# EAGLE design PoElli-Nucleo (EAGLE 7.1.0)
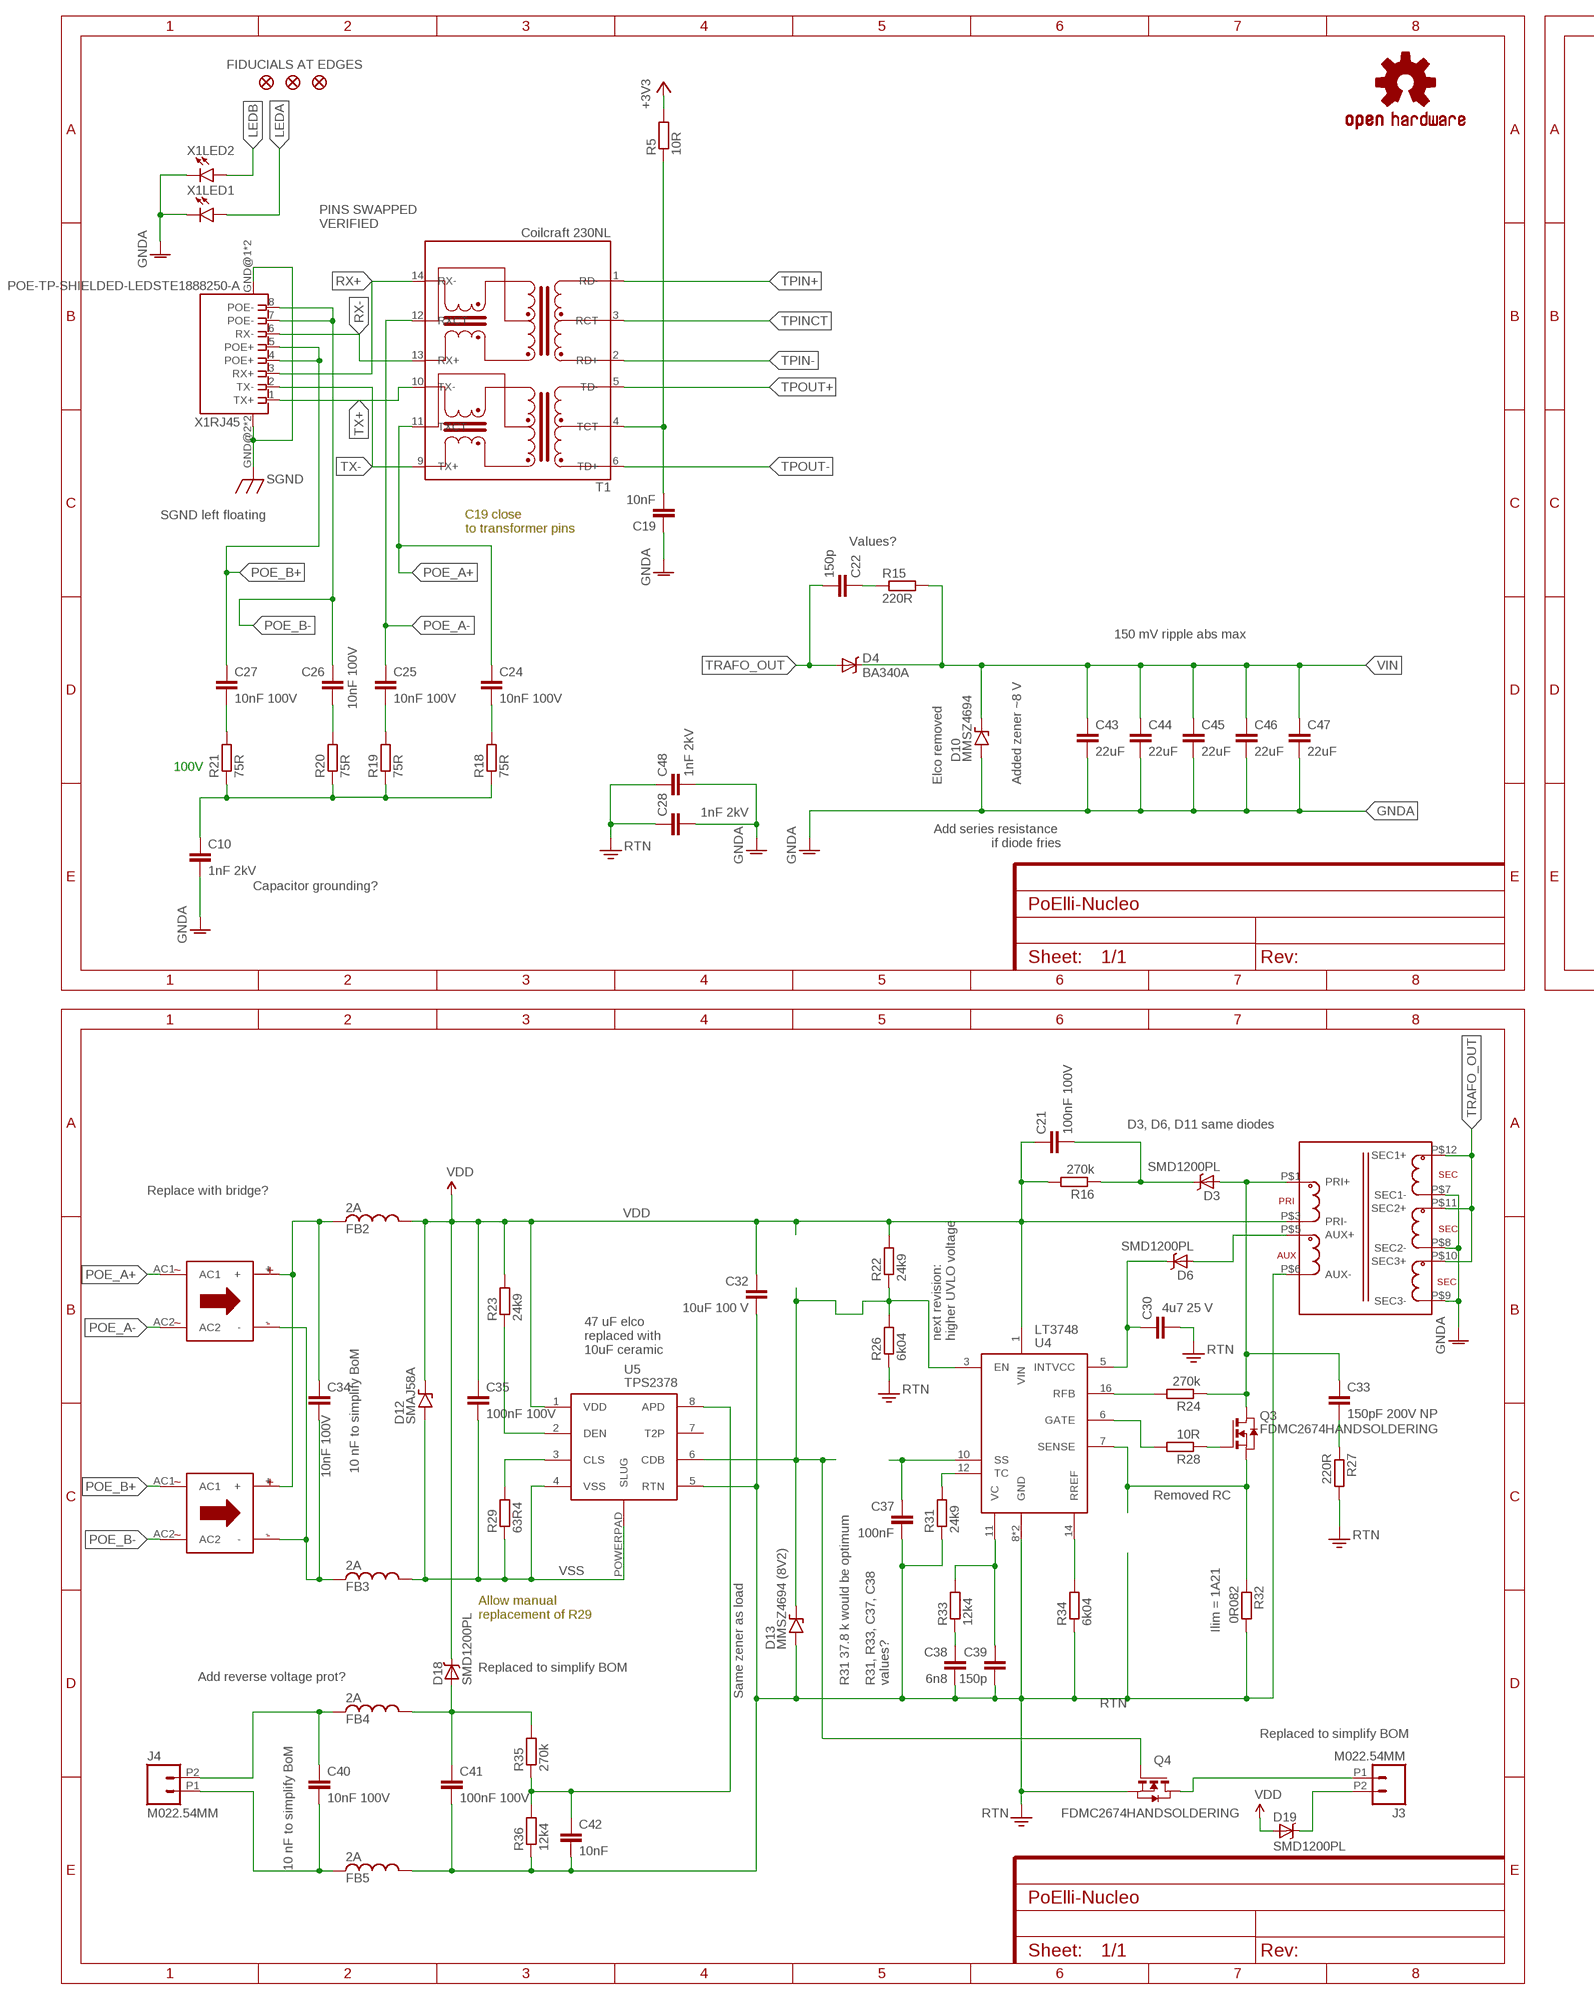
[diagram p0: schematic, sheet 1, part 1 of 2]
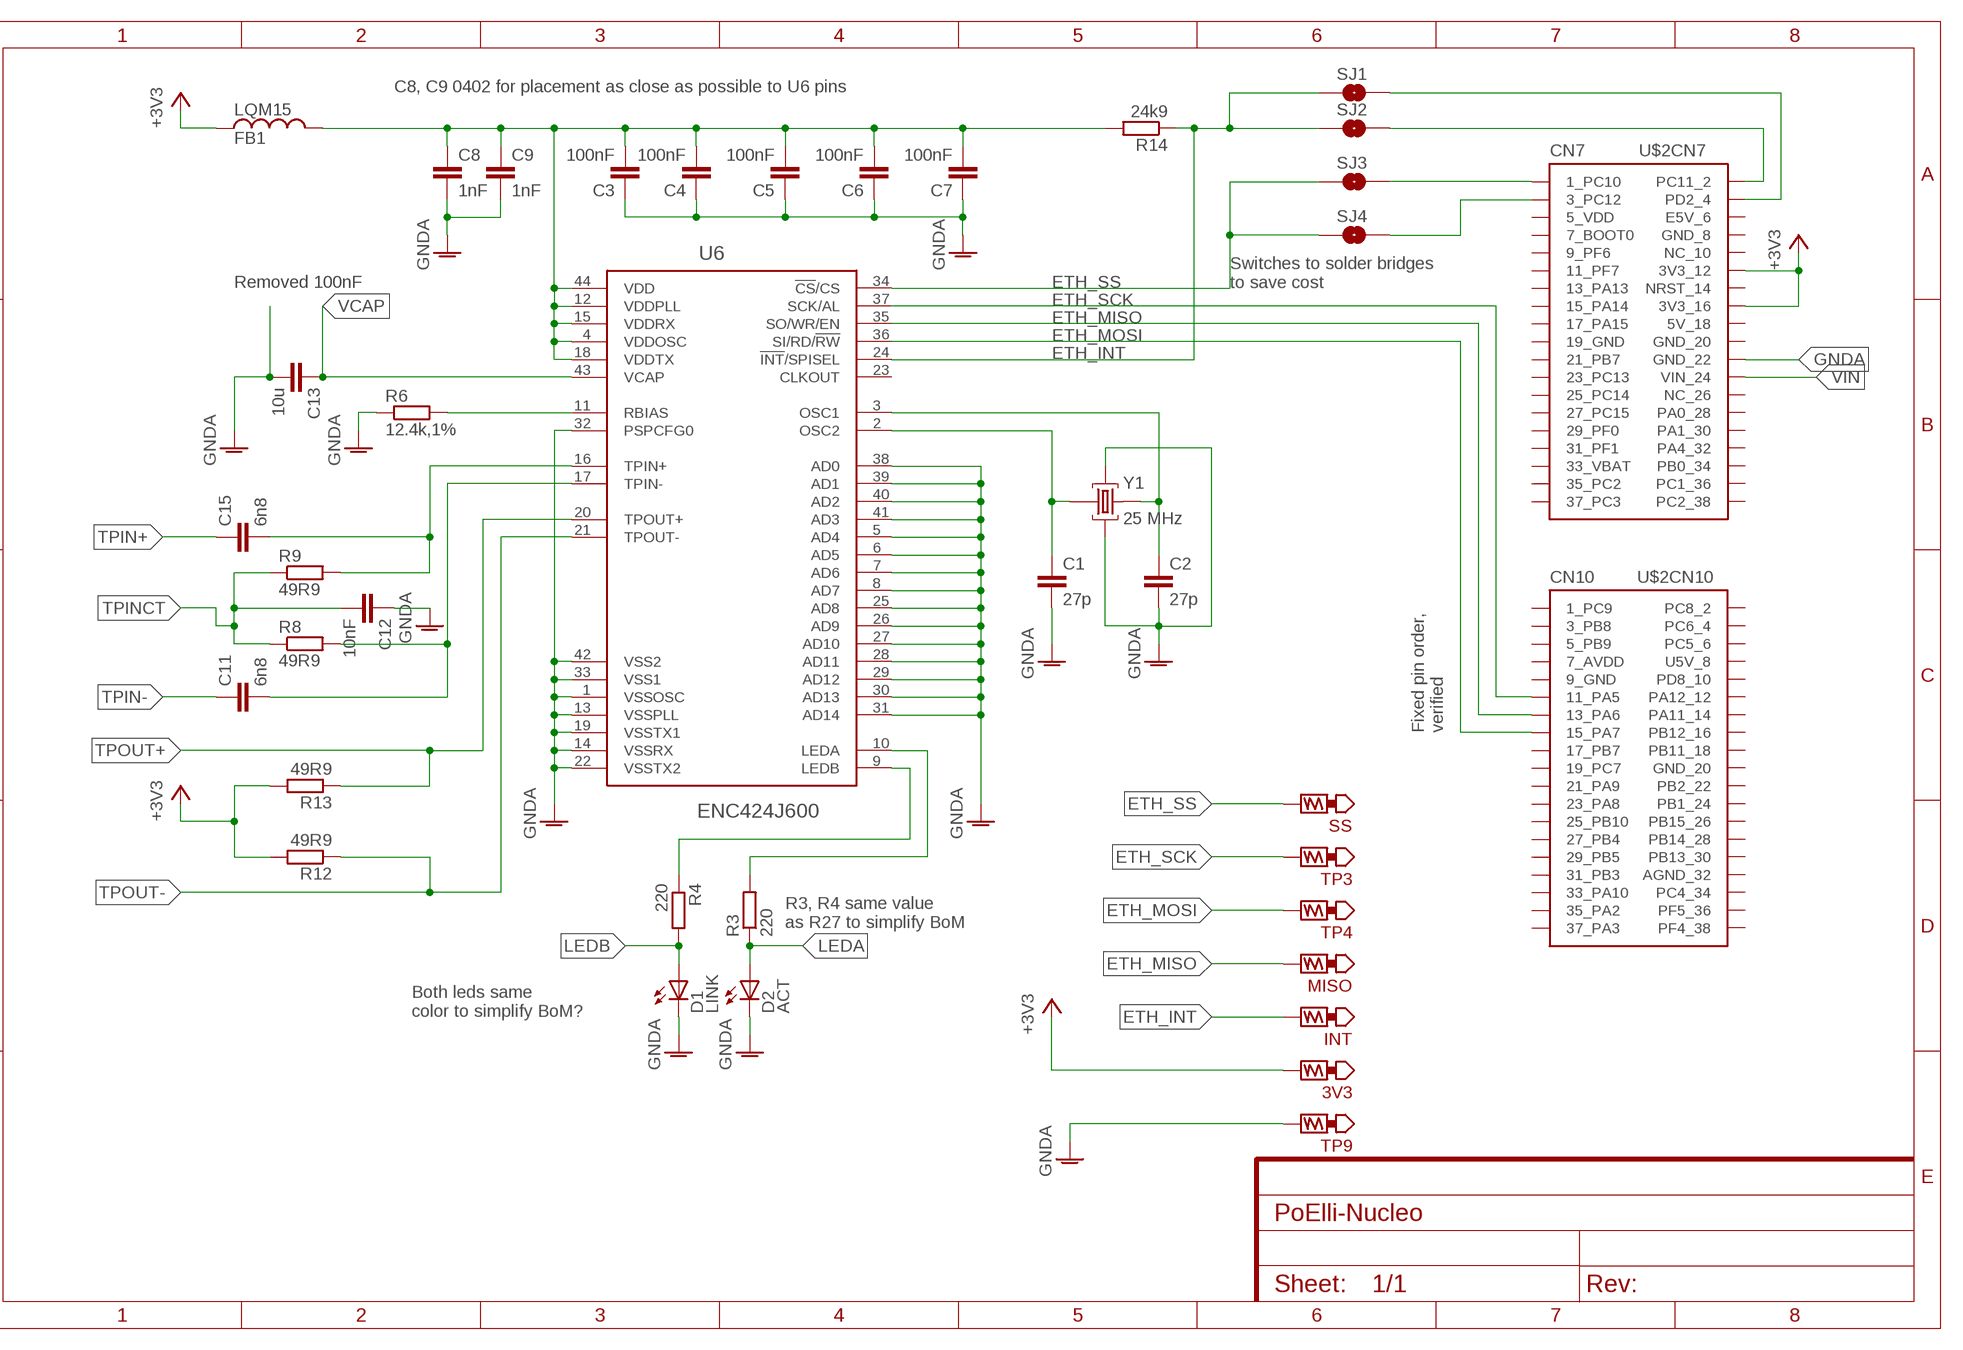
[diagram p1: schematic, sheet 1, part 2 of 2]

## Parts
3V3  3V3  TEST_POINT-5000  [TP_5000]
B1  BRIDGE-RECTIFIER  [MBS1]
B2  BRIDGE-RECTIFIER  [MBS1]
C1  27p  C0603-B  [SMD0603-B]
C2  27p  C0603-B  [SMD0603-B]
C3  100nF  C0603-B  [SMD0603-B]
C4  100nF  C0603-B  [SMD0603-B]
C5  100nF  C0603-B  [SMD0603-B]
C6  100nF  C0603-B  [SMD0603-B]
C7  100nF  C0603-B  [SMD0603-B]
C8  1nF  C0402-B  [SMD0402-B]
C9  1nF  C0402-B  [SMD0402-B]
C10  1nF 2kV  C1206-A  [SMD1206-A]
C11  6n8  C0603-B  [SMD0603-B]
C12  10nF  C0603-B  [SMD0603-B]
C13  10u  C0603-B  [SMD0603-B]
C15  6n8  C0603-B  [SMD0603-B]
C19  10nF  C0603-B  [SMD0603-B]
C21  100nF 100V  C0603-B  [SMD0603-B]
C22  150p  C0603-B  [SMD0603-B]
C24  10nF 100V  C0603-B  [SMD0603-B]
C25  10nF 100V  C0603-B  [SMD0603-B]
C26  10nF 100V  C0603-B  [SMD0603-B]
C27  10nF 100V  C0603-B  [SMD0603-B]
C28  1nF 2kV  C1206-A  [SMD1206-A]
C30  4u7 25 V  C0603-B  [SMD0603-B]
C32  10uF 100 V  C2220-REFLOW  [SMD2220-REFLOW]
C33  150pF 200V NP  C0603-B  [SMD0603-B]
C34  10nF 100V  C0603-B  [SMD0603-B]
C35  100nF 100V  C0603-B  [SMD0603-B]
C37  100nF  C0603-B  [SMD0603-B]
C38  6n8  C0603-B  [SMD0603-B]
C39  150p  C0603-B  [SMD0603-B]
C40  10nF 100V  C0603-B  [SMD0603-B]
C41  100nF 100V  C0603-B  [SMD0603-B]
C42  10nF  C0603-B  [SMD0603-B]
C43  22uF  C1206-A  [SMD1206-A]
C44  22uF  C1206-A  [SMD1206-A]
C45  22uF  C1206-A  [SMD1206-A]
C46  22uF  C1206-A  [SMD1206-A]
C47  22uF  C1206-A  [SMD1206-A]
C48  1nF 2kV  C1206-A  [SMD1206-A]
D1  LINK  LED-GREEN0603  [LED-0603]
D2  ACT  LED-YELLOW0603  [LED-0603]
D3  SMD1200PL  SMD1XXPL  [SOD-123FL-A]
D4  BA340A  B340A  [SMA-DIODE]
D6  SMD1200PL  SMD1XXPL  [SOD-123FL-A]
D10  MMSZ4694  MMSZ4XXX  [SOD-123FL-A]
D12  SMAJ58A  [SMA]
D13  MMSZ4694 (8V2)  MMSZ4XXX  [SOD-123FL-A]
D18  SMD1200PL  SMD1XXPL  [SOD-123FL-A]
D19  SMD1200PL  SMD1XXPL  [SOD-123FL-A]
FB1  LQM15  FB-0603-A  [SMD0603-A]
FB2  2A  FB-0603-A  [SMD0603-A]
FB3  2A  FB-0603-A  [SMD0603-A]
FB4  2A  FB-0603-A  [SMD0603-A]
FB5  2A  FB-0603-A  [SMD0603-A]
FID1  FIDUCIAL1X2  [FIDUCIAL-1X2]
FID2  FIDUCIAL1X2  [FIDUCIAL-1X2]
FID3  FIDUCIAL1X2  [FIDUCIAL-1X2]
INT  TEST_POINT-5000  [TP_5000]
J3  M022.54MM  M022.54MM_SCREWTERM  [1X02_2.54_SCREWTERM]
J4  M022.54MM  M022.54MM_SCREWTERM  [1X02_2.54_SCREWTERM]
LOGO1  OSHW-LOGOM  [OSHW-LOGO-M]
MISO  MISO  TEST_POINT-5021  [TP_5021]
Q3  FDMC2674HANDSOLDERING  [MLP8L33_HS]
Q4  FDMC2674HANDSOLDERING  [MLP8L33_HS]
R3  220  R0603-A  [SMD0603-A]
R4  220  R0603-A  [SMD0603-A]
R5  10R  R0603-B  [SMD0603-B]
R6  12.4k,1%  R0603-B  [SMD0603-B]
R8  49R9  R0603-B  [SMD0603-B]
R9  49R9  R0603-B  [SMD0603-B]
R12  49R9  R0603-B  [SMD0603-B]
R13  49R9  R0603-B  [SMD0603-B]
R14  24k9  R0603-A  [SMD0603-A]
R15  220R  R0603-B  [SMD0603-B]
R16  270k  R0603-A  [SMD0603-A]
R18  75R  R0603-B  [SMD0603-B]
R19  75R  R0603-B  [SMD0603-B]
R20  75R  R0603-B  [SMD0603-B]
R21  75R  R0603-B  [SMD0603-B]
R22  24k9  R0603-B  [SMD0603-B]
R23  24k9  R0603-B  [SMD0603-B]
R24  270k  R0603-B  [SMD0603-B]
R26  6k04  R0603-B  [SMD0603-B]
R27  220R  R0603-B  [SMD0603-B]
R28  10R  R0603-B  [SMD0603-B]
R29  63R4  R0603-B  [SMD0603-B]
R31  24k9  R0603-B  [SMD0603-B]
R32  0R082  R0603-B  [SMD0603-B]
R33  12k4  R0603-B  [SMD0603-B]
R34  6k04  R0603-B  [SMD0603-B]
R35  270k  R0603-B  [SMD0603-B]
R36  12k4  R0603-B  [SMD0603-B]
SJ1  SOLDERJUMPERNC2  [SJ_2S-NOTRACE]
SJ2  SOLDERJUMPERNO  [SJ_2S-NO]
SJ3  SOLDERJUMPERNC2  [SJ_2S-NOTRACE]
SJ4  SOLDERJUMPERNO  [SJ_2S-NO]
SS  SS  TEST_POINT-5021  [TP_5021]
T1  Coilcraft 230NL  POE-ISOLATION-230NL  [COILCRAFT-ETH1-230L]
T2  FLYBACK-3_OUTPUTS_749119350  [WE_749119350]
TP3  SCK  TEST_POINT-5021  [TP_5021]
TP4  MOSI  TEST_POINT-5021  [TP_5021]
TP9  GND  TEST_POINT-5000  [TP_5000]
U4  LT3748  [MSOP16(12)]
U5  TPS2378  [SO08-POWERPAD]
U6  ENC424J600  [TQFP44-0.8MM]
U$2  NUCLEO-SHIELD-20PIN  [NUCLEO-SHIELD-UNDERSIDE-SHORT-20-PINHEADER]
X1  POE-TP-SHIELDED-LEDSTE1888250-A  [TE1888250-A]
Y1  25 MHz  CRYSTAL_WITH_GND  [CRYSTAL-SMD-3225-GND]

## Nets
+3V3: 3V3.P$1 FB1.P$1 R5.P$2 R12.P$2 R13.P$2 U$2.CN7_12(CN7:3V3_12) U$2.CN7_16(CN7:3V3_16)
ENC-3V3: C3.P$2 C4.P$2 C5.P$2 C6.P$2 C7.P$2 C8.1 C9.1 FB1.P$2 R14.P$2 U6.4(VDDOSC) U6.12(VDDPLL) U6.15(VDDRX) U6.18(VDDTX) U6.44(VDD)
ETH_INT: INT.P$1 R14.P$1 SJ1.1 SJ2.1 U6.24(!INT!/SPISEL)
ETH_MISO: MISO.P$1 U6.35(SO/WR/EN) U$2.CN10_13(CN10:13_PA6)
ETH_MOSI: TP4.P$1 U6.36(SI/RD/!RW) U$2.CN10_15(CN10:15_PA7)
ETH_SCK: TP3.P$1 U6.37(SCK/AL) U$2.CN10_11(CN10:11_PA5)
ETH_SS: SJ3.1 SJ4.1 SS.P$1 U6.34(!CS!/CS)
GNDA: C1.P$2 C2.P$2 C3.P$1 C4.P$1 C5.P$1 C6.P$1 C7.P$1 C8.2 C9.2 C10.P$2 C12.P$1 C13.P$2 C19.P$1 C28.P$2 C43.P$2 C44.P$2 C45.P$2 C46.P$2 C47.P$2 C48.P$2 D1.C D2.C D10.A R6.P$1 T2.P$7(SEC1-) T2.P$8(SEC2-) T2.P$9(SEC3-) TP9.P$1 U6.1(VSSOSC) U6.5(AD4) U6.6(AD5) U6.7(AD6) U6.8(AD7) U6.13(VSSPLL) U6.14(VSSRX) U6.19(VSSTX1) U6.22(VSSTX2) U6.25(AD8) U6.26(AD9) U6.27(AD10) U6.28(AD11) U6.29(AD12) U6.30(AD13) U6.31(AD14) U6.32(PSPCFG0) U6.33(VSS1) U6.38(AD0) U6.39(AD1) U6.40(AD2) U6.41(AD3) U6.42(VSS2) U$2.CN7_22(CN7:GND_22) X1.9(LED1:C) X1.12(LED2:C) Y1.2(GND) Y1.4(GND)
INTVCC: C30.P$1 D6.C U4.5(INTVCC)
LEDA: D2.A R3.P$1 X1.10(LED1:A)
LEDB: D1.A R4.P$2 X1.11(LED2:A)
N$3: J3.P1 Q4.5(D) Q4.6(D) Q4.7(D) Q4.8(D) Q4.F1(D)
N$4: D19.C J3.P2
N$5: C10.P$1 R18.P$1 R19.P$1 R20.P$1 R21.P$1
N$6 [PoE 48V 1A]: B1.+ B2.+ C34.P$1 FB2.P$1
N$7: R31.P$2 U4.12(TC)
N$8 [PoE 48V 1A]: B1.- B2.- C34.P$2 FB3.P$1
N$11: SJ3.2 U$2.CN7_1(CN7:1_PC10)
N$12: SJ4.2 U$2.CN7_3(CN7:3_PC12)
N$13: SJ2.2 U$2.CN7_2(CN7:PC11_2)
N$14: SJ1.2 U$2.CN7_4(CN7:PD2_4)
N$15: C33.P$2 R27.P$1
N$16: C22.P$1 R15.P$1
N$18: R23.P$1 U5.2(DEN)
N$19: R29.P$2 U5.3(CLS)
N$22: C39.P$1 R33.P$2 U4.11(VC)
N$23: C38.P$1 R33.P$1
N$24: R28.P$2 U4.6(GATE)
N$25: Q3.4(G) R28.P$1
N$26 [PoE 48V 1A]: Q3.1(S) Q3.2(S) Q3.3(S) R32.P$1 U4.7(SENSE)
N$28 [High voltage 200V 1A]: C33.P$1 D3.A Q3.5(D) Q3.6(D) Q3.7(D) Q3.8(D) Q3.F1(D) R24.P$1 T2.P$1(PRI+)
N$29: D6.A T2.P$5(AUX+)
N$31: R24.P$2 U4.16(RFB)
N$32: R34.P$2 U4.14(RREF)
N$33: C21.P$2 D3.C R16.P$1
N$37: C1.P$1 U6.2(OSC2) Y1.1(C1)
N$39: C11.P$2 R8.P$2 U6.17(TPIN-)
N$40: C19.P$2 R5.P$1 T1.4(TCT)
N$41: R4.P$1 U6.9(LEDB)
N$42: R3.P$2 U6.10(LEDA)
N$45: R6.P$2 U6.11(RBIAS)
N$47: C2.P$1 U6.3(OSC1) Y1.3(C2)
N$48: C27.P$2 R21.P$2
N$50: C24.P$2 R18.P$2
N$51: C25.P$2 R19.P$2
N$52: C26.P$2 R20.P$2
N$53 [PoE 48V 1A]: C40.P$1 FB4.P$1 J4.P2
N$54: C42.P$1 R35.P$1 R36.P$2 U5.8(APD)
N$55 [PoE 48V 1A]: C40.P$2 FB5.P$1 J4.P1
N$59: C15.P$2 R9.P$2 U6.16(TPIN+)
N$76 [PoE 48V 1A]: C41.P$1 D18.A FB4.P$2 R35.P$2
POE_A+ [PoE 48V 1A]: B1.AC1 C24.P$1 T1.11(TXCT)
POE_A- [PoE 48V 1A]: B1.AC2 C25.P$1 T1.12(RXCT)
POE_B+ [PoE 48V 1A]: B2.AC1 C27.P$1 X1.4(RJ45:POE+) X1.5(RJ45:POE+)
POE_B- [PoE 48V 1A]: B2.AC2 C26.P$1 X1.7(RJ45:POE-) X1.8(RJ45:POE-)
RTN [PoE 48V 1A]: C28.P$1 C30.P$2 C32.P$2 C37.P$2 C38.P$2 C39.P$2 C41.P$2 C42.P$2 C48.P$1 D13.A FB5.P$2 Q4.1(S) Q4.2(S) Q4.3(S) R26.P$1 R27.P$2 R31.P$1 R32.P$2 R34.P$1 R36.P$1 T2.P$6(AUX-) U4.8(GND) U4.9(GND) U5.5(RTN)
RX+ [PoE 48V 1A]: T1.14(RX-) X1.3(RJ45:RX+)
RX- [PoE 48V 1A]: T1.13(RX+) X1.6(RJ45:RX-)
SGND: X1.GND@1(RJ45:GND) X1.GND@2(RJ45:GND) X1.GND@3(RJ45:GND) X1.GND@4(RJ45:GND)
TPIN+: C15.P$1 T1.1(RD-)
TPIN-: C11.P$1 T1.2(RD+)
TPINCT: C12.P$2 R8.P$1 R9.P$1 T1.3(RCT)
TPOUT+: R13.P$1 T1.5(TD-) U6.20(TPOUT+)
TPOUT-: R12.P$1 T1.6(TD+) U6.21(TPOUT-)
TRAFO_OUT [High current 3A (low voltage)]: C22.P$2 D4.A T2.P$10(SEC3+) T2.P$11(SEC2+) T2.P$12(SEC1+)
TX+ [PoE 48V 1A]: T1.10(TX-) X1.1(RJ45:TX+)
TX-: T1.9(TX+) X1.2(RJ45:TX-)
U4_EN: D13.C Q4.4(G) R22.P$1 R26.P$2 U4.3(EN) U5.6(CDB)
U4_SS: C37.P$1 U4.10(SS)
VCAP: C13.P$1 U6.43(VCAP)
VDD [PoE 48V 1A]: C21.P$1 C32.P$1 C35.P$1 D12.C D18.C D19.A FB2.P$2 R16.P$2 R22.P$2 R23.P$2 T2.P$3(PRI-) U4.1(VIN) U5.1(VDD)
VIN [High current 3A (low voltage)]: C43.P$1 C44.P$1 C45.P$1 C46.P$1 C47.P$1 D4.C D10.C R15.P$2 U$2.CN7_24(CN7:VIN_24)
VSS [PoE 48V 1A]: C35.P$2 D12.A FB3.P$2 R29.P$1 U5.4(VSS) U5.POWERPAD(SLUG)
Unconnected: U5.7(T2P) U6.23(CLKOUT) U$2.CN7_5(CN7:5_VDD) U$2.CN7_6(CN7:E5V_6) U$2.CN7_7(CN7:7_BOOT0) U$2.CN7_8(CN7:GND_8) U$2.CN7_9(CN7:9_PF6) U$2.CN7_10(CN7:NC_10) U$2.CN7_11(CN7:11_PF7) U$2.CN7_13(CN7:13_PA13) U$2.CN7_14(CN7:NRST_14) U$2.CN7_15(CN7:15_PA14) U$2.CN7_17(CN7:17_PA15) U$2.CN7_18(CN7:5V_18) U$2.CN7_19(CN7:19_GND) U$2.CN7_20(CN7:GND_20) U$2.CN7_21(CN7:21_PB7) U$2.CN7_23(CN7:23_PC13) U$2.CN7_25(CN7:25_PC14) U$2.CN7_26(CN7:NC_26) U$2.CN7_27(CN7:27_PC15) U$2.CN7_28(CN7:PA0_28) U$2.CN7_29(CN7:29_PF0) U$2.CN7_30(CN7:PA1_30) U$2.CN7_31(CN7:31_PF1) U$2.CN7_32(CN7:PA4_32) U$2.CN7_33(CN7:33_VBAT) U$2.CN7_34(CN7:PB0_34) U$2.CN7_35(CN7:35_PC2) U$2.CN7_36(CN7:PC1_36) U$2.CN7_37(CN7:37_PC3) U$2.CN7_38(CN7:PC2_38) U$2.CN10_1(CN10:1_PC9) U$2.CN10_2(CN10:PC8_2) U$2.CN10_3(CN10:3_PB8) U$2.CN10_4(CN10:PC6_4) U$2.CN10_5(CN10:5_PB9) U$2.CN10_6(CN10:PC5_6) U$2.CN10_7(CN10:7_AVDD) U$2.CN10_8(CN10:U5V_8) U$2.CN10_9(CN10:9_GND) U$2.CN10_10(CN10:PD8_10) U$2.CN10_12(CN10:PA12_12) U$2.CN10_14(CN10:PA11_14) U$2.CN10_16(CN10:PB12_16) U$2.CN10_17(CN10:17_PB7) U$2.CN10_18(CN10:PB11_18) U$2.CN10_19(CN10:19_PC7) U$2.CN10_20(CN10:GND_20) U$2.CN10_21(CN10:21_PA9) U$2.CN10_22(CN10:PB2_22) U$2.CN10_23(CN10:23_PA8) U$2.CN10_24(CN10:PB1_24) U$2.CN10_25(CN10:25_PB10) U$2.CN10_26(CN10:PB15_26) U$2.CN10_27(CN10:27_PB4) U$2.CN10_28(CN10:PB14_28) U$2.CN10_29(CN10:29_PB5) U$2.CN10_30(CN10:PB13_30) U$2.CN10_31(CN10:31_PB3) U$2.CN10_32(CN10:AGND_32) U$2.CN10_33(CN10:33_PA10) U$2.CN10_34(CN10:PC4_34) U$2.CN10_35(CN10:35_PA2) U$2.CN10_36(CN10:PF5_36) U$2.CN10_37(CN10:37_PA3) U$2.CN10_38(CN10:PF4_38)

## Notes on the sheet
- FIDUCIALS AT EDGES | C8, C9 0402 for placement as close as possible to U6 pins
- Removed 100nF
- Switches to solder bridges
  to save cost
- PINS SWAPPED
  VERIFIED
- SGND left floating
- C19 close 
  to transformer pins
- Values?
- Fixed pin order, 
  verified
- 150 mV ripple abs max
- R3, R4 same value 
  as R27 to simplify BoM
- Both leds same 
  color to simplify BoM?
- 100V
- Elco removed | Added zener ~8 V
- Add series resistance 
  if diode fries
- Capacitor grounding?
- D3, D6, D11 same diodes
- Replace with bridge?
- next revision:
  higher UVLO voltage
- 47 uF elco 
  replaced with 
  10uF ceramic
- 10 nF to simplify BoM
- Removed RC
- Allow manual 
  replacement of R29
- Ilim = 1A21
- Add reverse voltage prot? | Replaced to simplify BOM
- R31 37.8 k would be optimum
- R31, R33, C37, C38
  values?
- Same zener as load
- Replaced to simplify BOM
- 10 nF to simplify BoM

## Library data of the parts
3V3 INT MISO SS TP3 TP4 TP9 = ELL-i-Passives:TEST_POINT: Used for easier attachment of measuring equipment. Has both test loops and bare copper area.
B1 B2 = ELL-i-DIscreteSemi:BRIDGE-RECTIFIER: Rectifier bridge, single phase
C1-C13 C15 C19 C21 C22 C24-C28 C30 C32-C35 C37-C48 = ELL-i-Passives:C: Surface Mount Capasitors — in standard sizes A capacitor used to store energy electrostatically in an electric field. If you need a high-value capacitor, consider using a polarised capacitor to save space. Wikipedia article on capacitors <https://en.wikipedia.org/wiki/Capacitor>
D1 = SparkFun-LED:LED-GREEN: Various green LEDs Green LEDs used in SFE Production 0603- DIO-00821 LARGE- DIO-00862 LILYPAD- DIO-09910; PROD_ID: DIO-00821; VALUE: GREEN
D2 = SparkFun-LED:LED-YELLOW: Yellow SMD LEDs LilyPad 1206- DIO-09909 0603- DIO-09003; PROD_ID: DIO-09003
D3 D6 D18 D19 = ELL-i-DIscreteSemi:SMD1XXPL: Surface mount schottky diodes, 50->200 V, 1 A DC This series of schottky diodes has SOD-123-FL package. Datasheet. <http://www.mccsemi.com/up_pdf/SMD15PL-SMD1200PL%28SOD-123FL%29.pdf>
D4 = SparkFun-DiscreteSemi:B340A: Schottky Diode 3A-40V; PROD_ID: DIO-09886
D10 D13 = ELL-i-DIscreteSemi:MMSZ4XXX: 500 mV zener diodes, SOD-123, 1.8->39 V MMSZ4XXX is series of zener diodes, Datasheet <http://www.mccsemi.com/up_pdf/MMSZ4678-MMSZ4716%28SOD-123%29.pdf>.
D12 = ELL-i-DIscreteSemi:SMAJ58A
FB1-FB5 = ELL-i-Passives:FB: Ferrite beads Ferrite beads are choke coils used to suppress high frequency noise in electronic circuits. Wikipedia article on ferrite beads <https://en.wikipedia.org/wiki/Ferrite_bead>
FID1-FID3 = SparkFun-Aesthetics:FIDUCIAL: Fiducial Alignment Points Various fiducial points for machine vision alignment.
J3 J4 = SparkFun-Connectors:M02: Standard 2-pin 0.1" header. Use with - straight break away headers ( PRT-00116) - right angle break away headers (PRT-00553) - swiss pins (PRT-00743) - machine pins (PRT-00117) - female headers (PRT-00115) Molex polarized connector foot print use with: PRT-08233 with associated crimp pins and housings. 2.54_SCREWTERM for use with PRT-10571. 3.5mm Screw Terminal footprints for PRT-08084 5mm Screw Terminal footprints for use with PRT-08433
LOGO1 = SparkFun-Aesthetics:OSHW-LOGO: Open Source Hardware Logo This logo indicates the piece of hardware it is found on incorporates a OSHW license and/or adheres to the definition of open source hardware found here: http://freedomdefined.org/OSHW
Q3 Q4 = ELL-i-DIscreteSemi:FDMC2674: 220V N-Channel UltraFET Trench MOSFET This is a power MOSFET, capable of passing 2A of current and lasting some 200V, in a small MLP package. For a typical flyback converter, you need the switching FET to last much higher voltage than the nominal primary side voltage, as the flyback generates a high parasitic voltage at the time the FET switches off, before the so-called snubber circuit is able to absorb it. Datasheet <http://www.fairchildsemi.com/ds/FD/FDMC2674.pdf‎>
R3-R6 R8 R9 R12-R16 R18-R24 R26-R29 R31-R36 = ELL-i-Passives:R: Surface Mount Resistor — in standard sizes
SJ1-SJ4 = SparkFun-Passives:SOLDERJUMPER: Solder Jumper Standard SMD solder jumper. Used to automate production. Two varients : Normally Open and Normally Closed are the same, but have different paste layers. NC will have a large amount of paste and should jumper during reflow.
T1 = ELL-i-Transformers:POE-ISOLATION: Power-over-Ethernet isolation transformers In twisted pair Ethernet networks, there is a 1500V isolation transformer between the network cable and the connected device. In Power-over-Ethernet devices, the transformer provides the extra function of allowing the DC power to be extracted from the cable-side center taps of the transformer. For high-power PoE, the transformer cable-side winding must be of thick enough wire (i.e. have low-enough resistance) to carry the DC current without warming up too much. Isolation transformers <https://en.wikipedia.org/wiki/Isolation_transformer> (general article) Power-over-Ethernet <https://en.wikipedia.org/wiki/Power_over_Ethernet> (general article)
T2 = ELL-i-Transformers:FLYBACK-3_OUTPUTS: Flyback transformer with 3 output windings
U4 = ELL-i-PowerIC:LT3748: 100V Isolated Flyback Controller A switching regulator controller designed for the isolated flyback topology. Drives an external N-channel power MOSFET from an internally regulated 7V supply. No third winding or opto-isolator are required. Product page <http://www.linear.com/product/LT3748> Datasheet <http://www.linear.com/docs/29653> Wiki page <https://github.com/Ell-i/ELL-i-Eagle-Libraries/wiki/PowerIC-LT3748>
U5 = ELL-i-PowerIC:TPS2378: TI 802.3at Power-over-Ethernet controller with an integrated FET This IC contains all of the features needed to implement an IEEE802.3at type-2 powered device (PD). It includes an 0.5 Ω RDSON Power FET, which enables continuous 0.85 A current. It supports also auxiliary power. Product page <http://www.ti.com/product/tps2378> Datasheet <http://www.ti.com/lit/gpn/tps2378> Wiki page <https://github.com/Ell-i/ELL-i-Eagle-Libraries/wiki/PowerIC-TPS2378>
U6 = ELL-i-DigitalIC:ENC424J600: ENC424J600 The ENC424J600 and ENC624J600 are stand-alone, Fast Ethernet controllers with an industry standard Serial Peripheral Interface (SPI) or a flexible parallel interface. They are designed to serve as an Ethernet network interface for any microcontroller equipped with SPI or a standard parallel port Not reviewed. Datasheet <http://ww1.microchip.com/downloads/en/DeviceDoc/39935b.pdf>
U$2 = ELL-i-Boards:NUCLEO-SHIELD: Shield template for ST Nucleo boards
X1 = ELL-i-Connectors:POE-TP-SHIELDED-LEDS: Twisted pair Power-over-Ethernet MDI connector, with protective ground and LEDs 8-wire Ethernet jack, with a protective ground and status LEDs. See the POE-TP device for more information.
Y1 = SparkFun-FreqCtrl:CRYSTAL_WITH_GND: Crystals with ground connection to case. A ground connection is used for mechanical stability and to minimize noise. Be careful to not overheat the body of crystal while soldering.

## Net classes
1 PoE 48V 1A: width 0.2 mm
2 High current 3A (low voltage): width 0.4 mm
3 High voltage 200V 1A: width 0.4 mm, clearance 0.5 mm

## Board
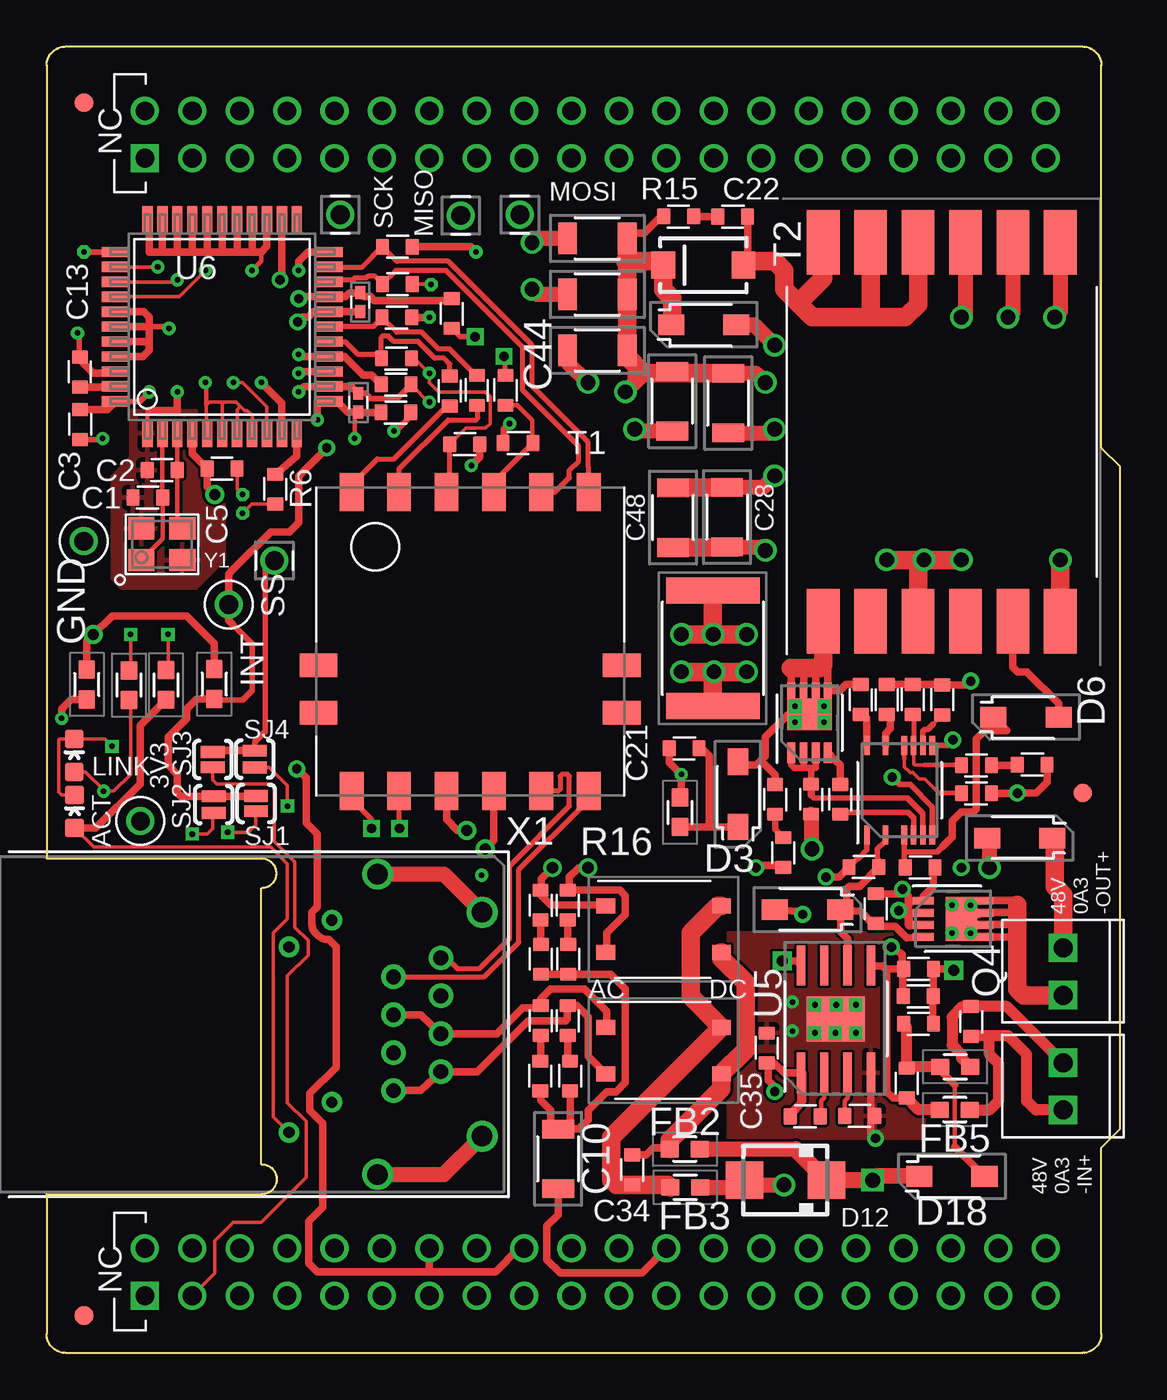
[diagram p2: board, top side]
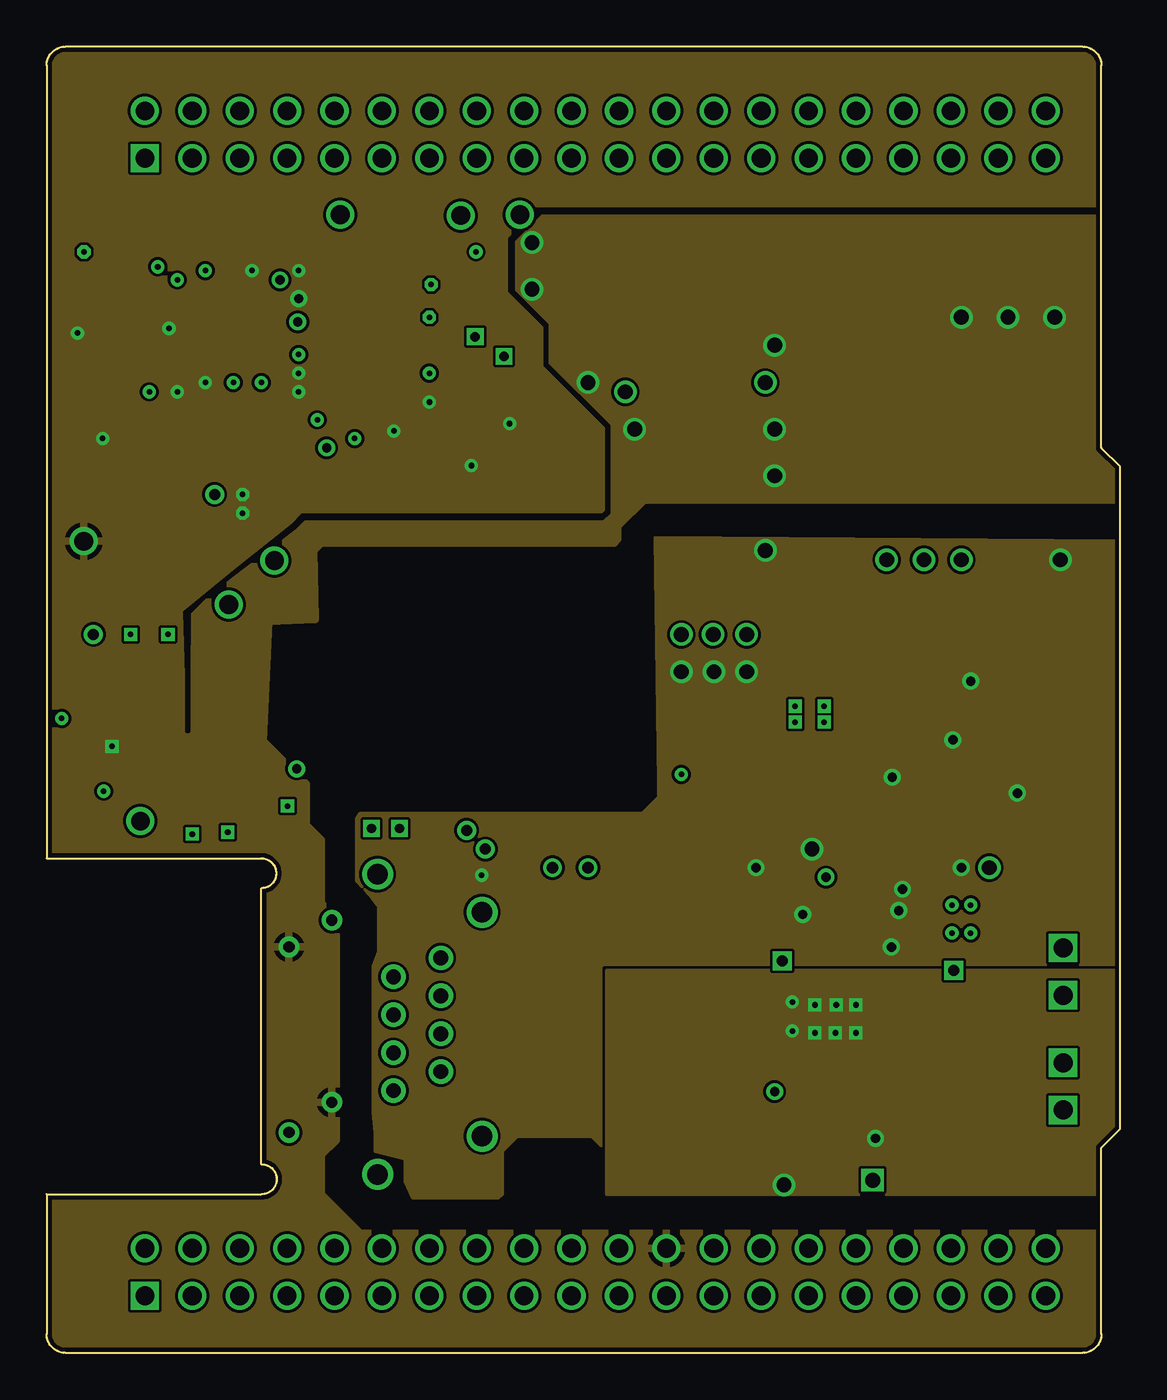
[diagram p3: board, inner layer Route2]
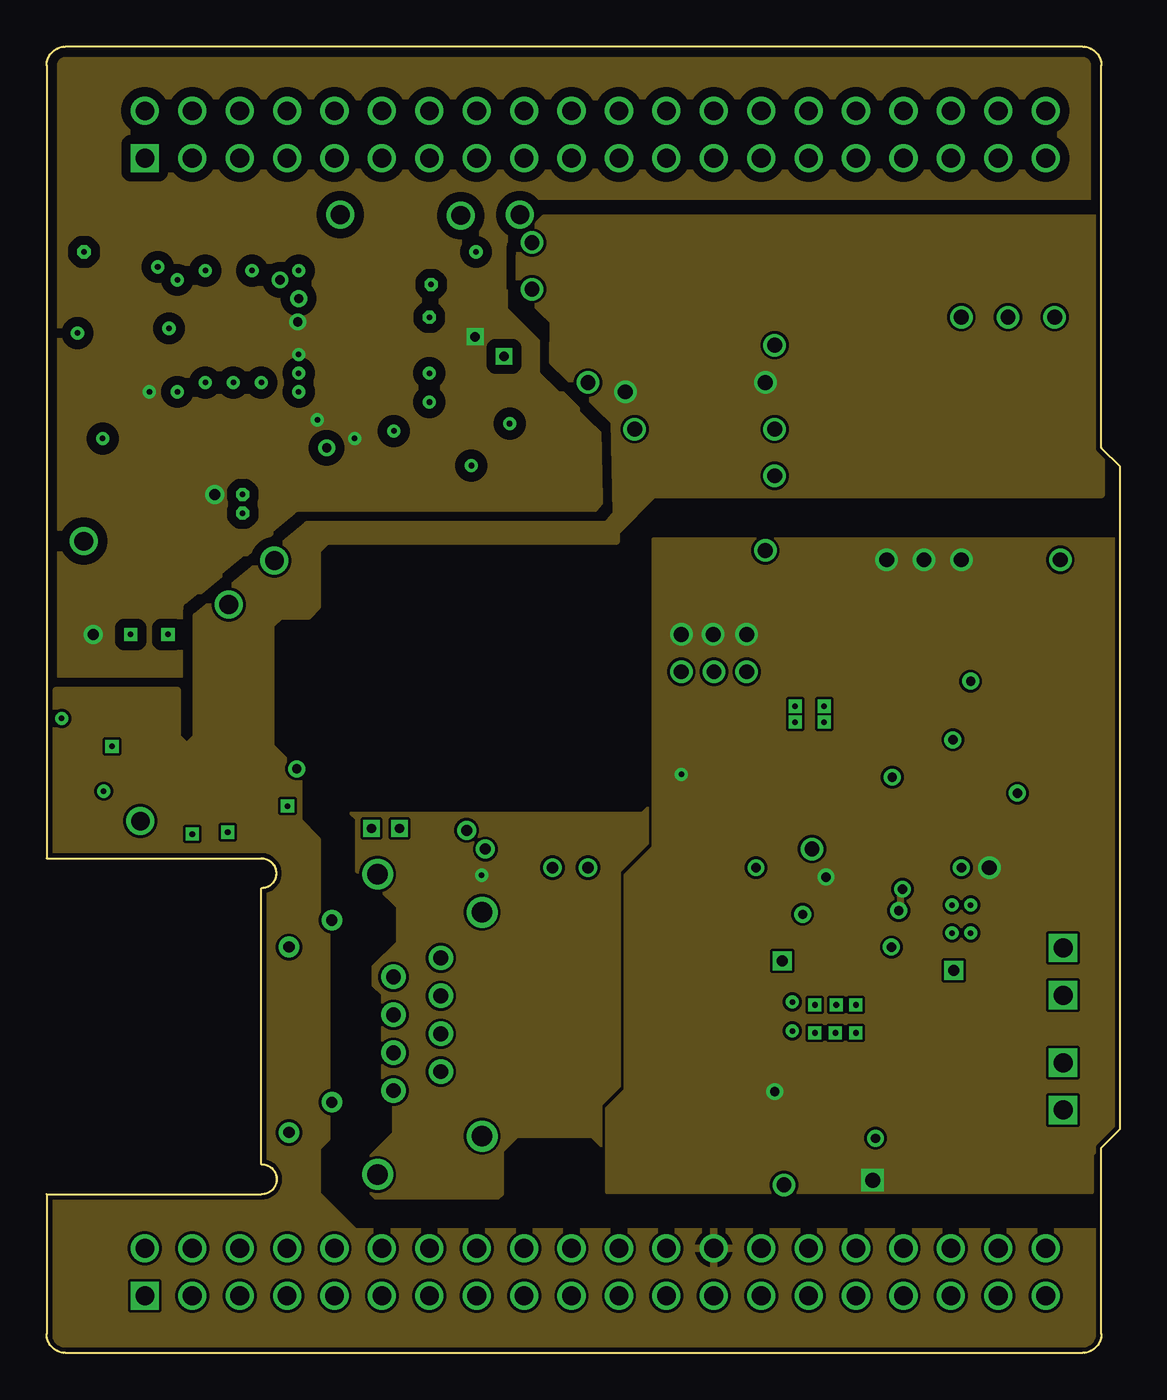
[diagram p4: board, inner layer Route15]
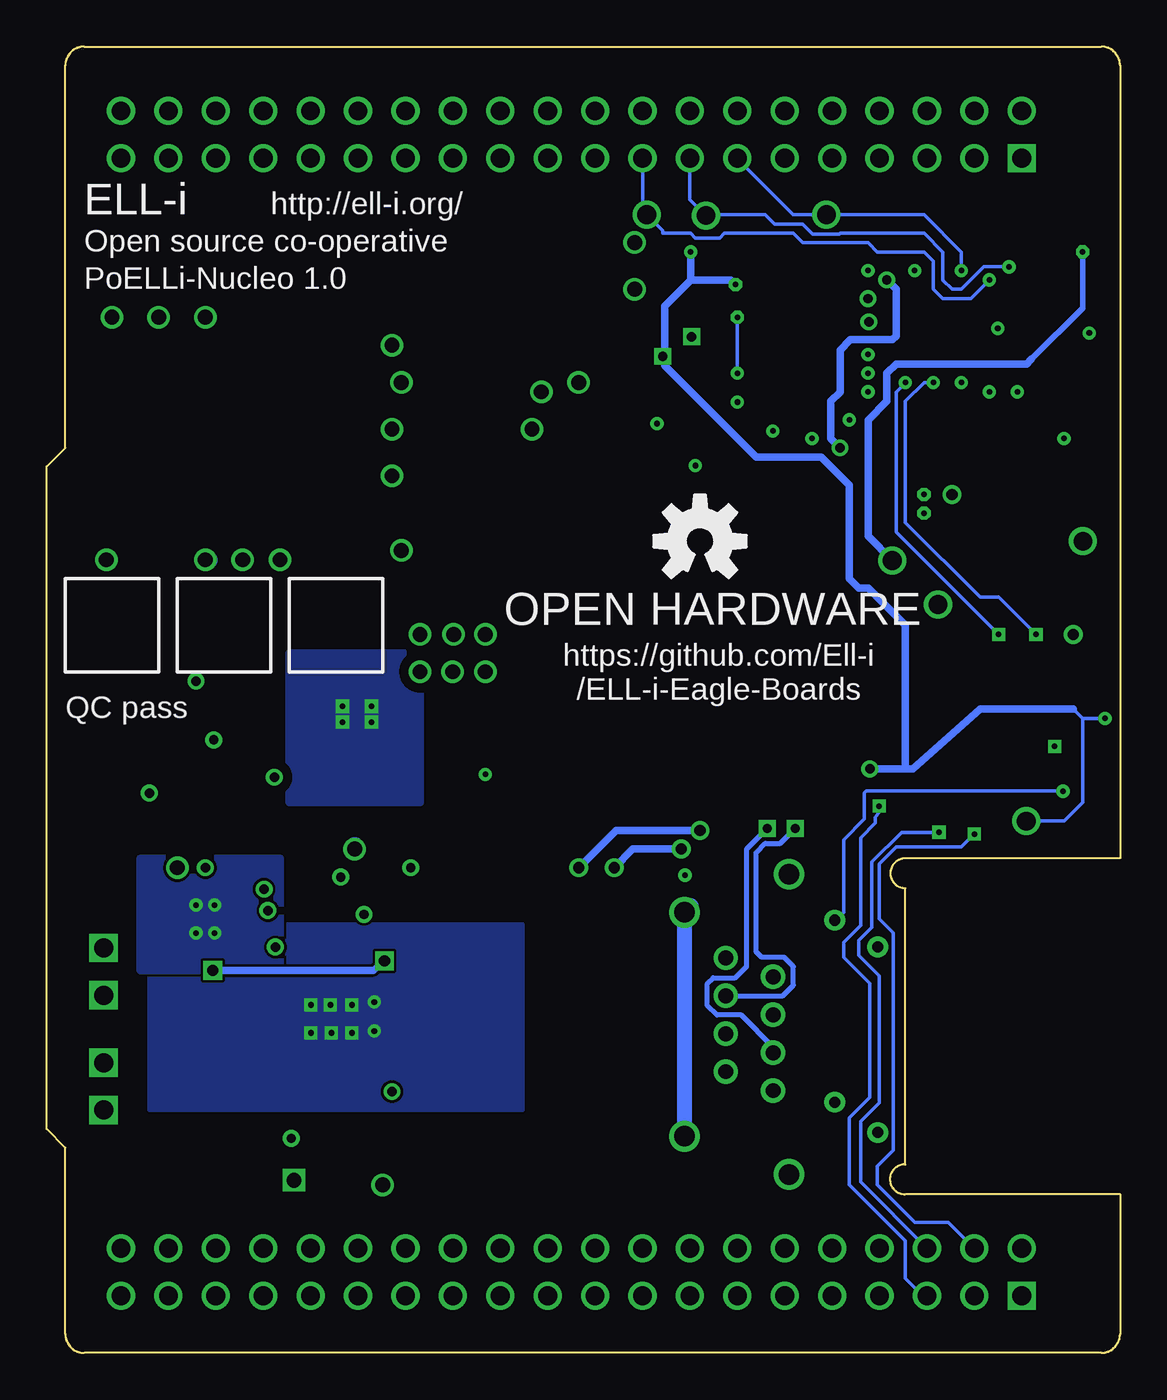
[diagram p5: board, bottom side, seen from below]

Size 57.5 x 70 mm. Coordinates in mm from the lower left corner, seen from the top.
Outline: 11.55,10.1 arc-180 11.5,8.5 0,8.5 0,1 arc90 1,0 55.5,0 arc90 56.5,1 56.5,11 57.5,12 57.5,47.5 56.5,48.5 56.5,69 arc90 55.5,70 1,70 arc90 0,69 0,26.5 11.5,26.5 arc-180 11.5,24.9 11.5,10.1
Copper layers ((1+2)*(15+16)): Top 0.035mm / dielectric 0.288mm / Route2 0.035mm / dielectric 0.834mm / Route15 0.035mm / dielectric 0.288mm / Bottom 0.035mm
Design rules "default *": minimum track width 0.15mm, minimum drill 0.3mm, track to track 6mil, track to pad 6mil, pad to pad 6mil, via to via 8mil, smd to smd 6mil, copper to edge 0.23mm, drill to drill 8mil, minimum pad ring 10mil, minimum via ring 8mil, stop-mask expansion 3mil, vias tented up to drill 0.9mm, thermal gap 10mil
tRestrict: area 54.7,29.2 to 56.3,30.8; 41 lines
bRestrict: 16 lines

### Footprints (pad centres in the part's own frame; a part is rotated, then mirrored left to right if it is on the bottom)
TP_5000 = drill 1: P$1 0,0
MBS1 = smd 1 x 0.8: + 3.1,-1.25; - 3.1,1.25; AC1 -3.1,1.25; AC2 -3.1,-1.25
SMD0603-B = smd 0.7 x 0.86: P$1 -0.8,0; P$2 0.8,0
SMD0402-B = smd 0.7 x 0.6: 1 -0.5,0; 2 0.5,0
SMD1206-A = smd 1 x 1.7: P$1 -1.6,0; P$2 1.6,0
SMD2220-REFLOW = smd 1.4 x 5: P$1 -3.1,0; P$2 3.1,0
LED-0603 = smd 1 x 1: A 0,-0.877; C 0,0.877
SOD-123FL-A = smd 1.4 x 1.1: A 1.75,0; C -1.75,0
SMA-DIODE = smd 1.27 x 1.47: A -2.15,0; C 2.15,0
SMA = smd 2 x 2: A 2.2,0; C -2.2,0
SMD0603-A = smd 1 x 0.9: P$1 -0.8,0; P$2 0.8,0
FIDUCIAL-1X2 = smd 1 x 1: 1 0,0
1X02_2.54_SCREWTERM = drill 1.016 square: P1 2.54,0; P2 0,0
TP_5021 = drill 1: P$1 0,0
MLP8L33_HS = smd 0.42 x 1.1: 1 -0.975,-1.6; 2 -0.325,-1.6; 3 0.325,-1.6; 4 0.975,-1.6; 5 0.975,1.6; 6 0.325,1.6; 7 -0.325,1.6; 8 -0.975,1.6 | smd 2.37 x 1.7: F1 0,0.45
SJ_2S-NOTRACE = smd 0.635 x 1.27: 1 -0.401,0; 2 0.413,0
SJ_2S-NO = smd 0.635 x 1.27: 1 -0.45,0; 2 0.45,0
COILCRAFT-ETH1-230L = smd 1.27 x 2.032: 1 -6.35,8.001; 2 -3.81,8.001; 3 -1.27,8.001; 4 1.27,8.001; 5 3.81,8.001; 6 6.35,8.001; 9 6.35,-8.001; 10 3.81,-8.001; 11 1.27,-8.001; 12 -1.27,-8.001; 13 -3.81,-8.001; 14 -6.35,-8.001 | smd 2.032 x 1.27: 7 8.128,-1.27; 8 8.128,-3.81; 15 -8.128,-3.81; 16 -8.128,-1.27
WE_749119350 = smd 1.75 x 3.45: P$1 -6.35,-10.15; P$2 -3.81,-10.15; P$3 -1.27,-10.15; P$4 1.27,-10.15; P$5 3.81,-10.15; P$6 6.35,-10.15; P$7 6.35,10.15; P$8 3.81,10.15; P$9 1.27,10.15; P$10 -1.27,10.15; P$11 -3.81,10.15; P$12 -6.35,10.15
MSOP16(12) = smd 0.3 x 1.02: 1 -1.75,-2.4; 3 -0.75,-2.4; 5 0.25,-2.4; 6 0.75,-2.4; 7 1.25,-2.4; 8 1.75,-2.4; 9 1.75,2.4; 10 1.25,2.4; 11 0.75,2.4; 12 0.25,2.4; 14 -0.75,2.4; 16 -1.75,2.4
SO08-POWERPAD = smd 0.45 x 2.15: 1 -1.875,-2.875; 2 -0.625,-2.875; 3 0.625,-2.875; 4 1.875,-2.875; 5 1.875,2.875; 6 0.625,2.875; 7 -0.625,2.875; 8 -1.875,2.875 | smd 3.1 x 2.4: POWERPAD 0,0
TQFP44-0.8MM = smd 0.55 x 1.5: 1 -4,-5.7; 2 -3.2,-5.7; 3 -2.4,-5.7; 4 -1.6,-5.7; 5 -0.8,-5.7; 6 0,-5.7; 7 0.8,-5.7; 8 1.6,-5.7; 9 2.4,-5.7; 10 3.2,-5.7; 11 4,-5.7; 23 4,5.7; 24 3.2,5.7; 25 2.4,5.7; 26 1.6,5.7; 27 0.8,5.7; 28 0,5.7; 29 -0.8,5.7; 30 -1.6,5.7; 31 -2.4,5.7; 32 -3.2,5.7; 33 -4,5.7 | smd 1.5 x 0.55: 12 5.7,-4; 13 5.7,-3.2; 14 5.7,-2.4; 15 5.7,-1.6; 16 5.7,-0.8; 17 5.7,0; 18 5.7,0.8; 19 5.7,1.6; 20 5.7,2.4; 21 5.7,3.2; 22 5.7,4; 34 -5.7,4; 35 -5.7,3.2; 36 -5.7,2.4; 37 -5.7,1.6; 38 -5.7,0.8; 39 -5.7,0; 40 -5.7,-0.8; 41 -5.7,-1.6; 42 -5.7,-2.4; 43 -5.7,-3.2; 44 -5.7,-4
NUCLEO-SHIELD-UNDERSIDE-SHORT-20-PINHEADER = drill 1: CN7_1 -31.55,23.02; CN7_2 -29.01,23.02; CN7_3 -31.55,20.48; CN7_4 -29.01,20.48; CN7_5 -31.55,17.94; CN7_6 -29.01,17.94; CN7_7 -31.55,15.4; CN7_8 -29.01,15.4; CN7_9 -31.55,12.86; CN7_10 -29.01,12.86; CN7_11 -31.55,10.32; CN7_12 -29.01,10.32; CN7_13 -31.55,7.78; CN7_14 -29.01,7.78; CN7_15 -31.55,5.24; CN7_16 -29.01,5.24; CN7_17 -31.55,2.7; CN7_18 -29.01,2.7; CN7_19 -31.55,0.16; CN7_20 -29.01,0.16; CN7_21 -31.55,-2.38; CN7_22 -29.01,-2.38; CN7_23 -31.55,-4.92; CN7_24 -29.01,-4.92; CN7_25 -31.55,-7.46; CN7_26 -29.01,-7.46; CN7_27 -31.55,-10; CN7_28 -29.01,-10; CN7_29 -31.55,-12.54; CN7_30 -29.01,-12.54; CN7_31 -31.55,-15.08; CN7_32 -29.01,-15.08; CN7_33 -31.55,-17.62; CN7_34 -29.01,-17.62; CN7_35 -31.55,-20.16; CN7_36 -29.01,-20.16; CN7_37 -31.55,-22.7; CN7_38 -29.01,-22.7; CN7_40 -29.01,25.56; CN10_1 29.41,23.02; CN10_2 31.95,23.02; CN10_3 29.41,20.48; CN10_4 31.95,20.48; CN10_5 29.41,17.94; CN10_6 31.95,17.94; CN10_7 29.41,15.4; CN10_8 31.95,15.4; CN10_9 29.41,12.86; CN10_10 31.95,12.86; CN10_11 29.41,10.32; CN10_12 31.95,10.32; CN10_13 29.41,7.78; CN10_14 31.95,7.78; CN10_15 29.41,5.24; CN10_16 31.95,5.24; CN10_17 29.41,2.7; CN10_18 31.95,2.7; CN10_19 29.41,0.16; CN10_20 31.95,0.16; CN10_21 29.41,-2.38; CN10_22 31.95,-2.38; CN10_23 29.41,-4.92; CN10_24 31.95,-4.92; CN10_25 29.41,-7.46; CN10_26 31.95,-7.46; CN10_27 29.41,-10; CN10_28 31.95,-10; CN10_29 29.41,-12.54; CN10_30 31.95,-12.54; CN10_31 29.41,-15.08; CN10_32 31.95,-15.08; CN10_33 29.41,-17.62; CN10_34 31.95,-17.62; CN10_35 29.41,-20.16; CN10_36 31.95,-20.16; CN10_37 29.41,-22.7; CN10_38 31.95,-22.7; CN10_39 31.95,25.56 | drill 1 square: CN7_39 -31.55,25.56; CN10_40 29.41,25.56
TE1888250-A = drill 0.8: 1 -3.556,9.64; 2 -2.54,7.1; 3 -1.524,9.64; 4 -0.508,7.1; 5 0.508,9.64; 6 1.524,7.1; 7 2.54,9.64; 8 3.556,7.1 | drill 0.6: 9 4.18,3.8; 10 5.8,1.5; 11 -5.58,3.8; 12 -4.14,1.5 | drill 1.1: GND@1 -8.045,6.25; GND@2 8.045,6.25; GND@3 -6,11.85; GND@4 6,11.85
CRYSTAL-SMD-3225-GND = smd 1.4 x 1.2: 1 -1.1,-0.85; 2 1.1,-0.85; 3 1.1,0.85; 4 -1.1,0.85

### Placement (x,y rotation side)
3V3  5.02,28.5 0 top
B1  33.05,22.7 0 top
B2  33.05,16.2 0 top
C1  5.42,45.83 180 top
C2  6.19,47.3 180 top
C3  1.79,49.75 90 top
C4  21.7,55.7 270 top
C5  9.4,47.39 180 top
C6  18.71,50.4 180 top
C7  18.72,51.9 180 top
C8  16.7,50.92 90 top
C9  16.8,56.31 90 top
C10  27.4,10.4 270 top
C11  23.05,51.58 90 top
C12  22.4,48.69 180 top
C13  1.78,52.56 90 top
C15  21.6,51.54 90 top
C19  25.25,48.76 0 top
C21  34.15,32.4 0 top
C22  36.75,60.89 0 top
C24  26.46,24 270 top
C25  27.91,24 270 top
C26  27.92,17.81 270 top
C27  26.47,17.81 270 top
C28  36.45,44.79 90 top
C30  46.79,26.02 0 top
C32  35.69,37.76 270 top
C33  39.02,29.66 270 top
C34  31.37,9.81 270 top
C35  38.58,16.34 90 top
C37  47.98,34.99 90 top
C38  52.79,31.52 0 top
C39  46.4,35.01 90 top
C40  49.52,17.76 270 top
C41  46.07,14.46 270 top
C42  46.71,20.58 180 top
C43  29.5,59.72 180 top
C44  29.5,53.72 180 top
C45  29.5,56.72 180 top
C46  36.51,50.9 270 top
C47  33.51,51 270 top
C48  33.55,44.76 90 top
D1  1.48,32.01 0 top
D2  1.49,29.01 0 top
D3  37.03,29.93 90 top
D4  35.18,58.29 180 top
D6  52.46,34.07 0 top
D10  35.2,55.1 0 top
D12  39.58,9.26 180 top
D13  40.76,23.75 180 top
D18  48.49,9.46 0 top
D19  52.13,27.59 180 top
FB1  2.15,35.82 90 top
FB2  34.19,10.92 0 top
FB3  34.21,8.87 0 top
FB4  48.67,15.33 180 top
FB5  48.65,13.03 180 top
FID1  2,2 0 top
FID2  2,67 0 top
FID3  55.5,30 0 top
INT  9.75,40.1 0 top
J3  54.45,21.7 270 top
J4  54.45,15.55 270 top
LOGO1  22.5,43.5 0 bottom
MISO  22.18,60.95 0 top
Q3  40.87,33.77 0 top
Q4  48.56,23.26 270 top
R3  6.39,35.8 90 top
R4  4.41,35.78 270 top
R5  24.58,51.58 90 top
R6  12.25,46.28 90 top
R8  18.76,55.49 180 top
R9  18.74,53.29 180 top
R12  18.79,59.27 0 top
R13  18.79,57.27 0 top
R14  8.98,35.84 90 top
R15  33.86,60.9 180 top
R16  33.93,28.97 90 top
R18  26.48,21.09 90 top
R19  27.94,21.09 90 top
R20  28.04,14.84 90 top
R21  26.44,14.84 90 top
R22  43.78,26.03 180 top
R23  40.64,12.68 180 top
R24  43.61,35.01 270 top
R26  44.42,23.81 270 top
R27  39.46,26.81 270 top
R28  42.51,29.66 270 top
R29  43.56,12.7 180 top
R31  49.81,29.99 180 top
R32  40.95,29.67 270 top
R33  49.81,31.49 180 top
R34  45.01,35.01 270 top
R35  46.71,17.64 180 top
R36  46.69,19.11 0 top
SJ1  11.22,29.44 270 top
SJ2  8.95,29.38 270 top
SJ3  8.9,31.8 270 top
SJ4  11.15,31.82 270 top
SS  12.2,42.46 90 top
T1  22.69,38.12 0 top
T2  47.95,49.35 0 top
TP3  15.73,61 0 top
TP4  25.35,61 0 top
TP9  1.99,43.5 0 top
U4  45.69,30.15 0 top
U5  42.28,17.89 0 top
U6  9.4,54.99 0 top
U$2  30.82,34.61 90 top
X1  11.48,17.61 270 top
Y1  6.17,43.33 0 top

### Tracks (layer width: path | path; a pad name or v marks a point on that pad's centre or on a via)
+3V3  (via drill 0.3, 0.5)
  Top 0.2: R13.P$2 20.58,57.27 v20.6,57.25
  Top 0.265: R5.P$2 24.58,53.32 v24.5,53.4
  Top 0.4: U$2.CN7_12 20.5,4.35 | R12.P$2 22.73,59.27 v23,59 | 15.5,21 15.5,21.75 15.1,22.15 arc-90 14.2,23.05 14.2,23.6 14.5,23.9 14.5,24.5 | 14.45,7.45 14.8,7.8 14.8,12.3 14.1,13 14.1,13.9 15.5,15.3 15.5,16 | 14.5,27 14.5,27.8 13.9,28.4 13.9,30.8 v13.4,31.3 | 0.8,34.3 v0.8,34 0.8,34.5 1.32,35.02 FB1.P$1
  Top 0.406: U$2.CN7_16 25.3,5.6 24.05,4.35 20.5,4.35 14.5,4.35 14.05,4.8 14.05,7.05 14.45,7.45 | 14.5,27 14.5,24.5 | 15.5,21 15.5,16
  Bottom 0.2: v20.6,57.25 20.7,57.25 | 2.5,34.5 2,34 | 2,34 2,29.5 3,28.5 3V3.P$1 | v0.8,34 2,34
  Bottom 0.265: v24.5,53.4 24.4,53.5 24.4,53.4
  Bottom 0.4: 11.5,31.3 11.5,39 13.5,41 14,41 14.5,41.5 14.5,46.5 16,48 19.5,48 24.4,52.9 24.4,53.5 24.4,56.1 23,57.5 | 23,57.5 20.85,57.5 v20.6,57.25 | v23,59 23,57.5
  Bottom 0.406: v13.4,31.3 11.5,31.3 11.1,31.3 7.5,34.5 2.5,34.5
ENC-3V3  (via drill 0.3, 0.5, 0.6)
  Top 0.2: C6.P$2 16,50.5 15.5,51 14.5,51
  Top 0.254: C6.P$2 16.5,50.4 v16.5,49
  Top 0.3: v22.95,54.45 22.15,54.45 C4.P$2 | U6.44 4.99,50.99 v5.5,51.5
  Top 0.4: U6.18 14.29,55.79 14,55.5 13.7,55.5 v13.45,55.25 | C7.P$2 17.42,52.4 16.95,52.4 15.96,53.39 U6.15 13.61,53.39 v13.5,53.5 | C6.P$2 16.72,50.4 C8.1 16.13,50.42 15.65,50.9 15.19,50.9 U6.12 | 14.5,51 v14.5,50 | FB1.P$2 2.15,38.15 v2.5,38.5
  Top 0.406: U6.4 7.8,48.19 C5.P$2 8.6,46.4 v9,46 | C3.P$2 3.26,50.55 U6.44 | U6.18 16.78,55.79 C9.1 | R14.P$2 8.98,38.02 7.5,39.5 3.5,39.5 v2.5,38.5
  Bottom 0.3: v5.5,51.5 5.55,51.45
  Bottom 0.4: v13.45,55.25 13.45,55.45 13.5,55.5 | v22.95,54.45 22.7,54.5 22.75,54.45 v22.95,54.45
  pour Route15 (isolate 0.5, rank 2): 6.5,36 0.5,36 0.5,69.5 1,70 55.5,70 56.5,69 56.5,62 26.5,62 24.5,60 24.5,55.9 26.3,54.1 26.3,52.65 29.65,49.3 29.65,45.3 29.55,45.2 13.55,45.25 7.1,39.9 7.1,36.1
ETH_INT  (via drill 0.5)
  Top 0.3: 9.95,39.05 11,38 11,35.5 10.5,35 9.14,35 R14.P$1
  Top 0.4: SJ2.1 7.17,29.83 7,30 7,31 6.5,31.5 6.5,33 7.5,34 7.5,34.5 8.04,35.04 R14.P$1 | 9.95,41.95 9.75,41.75 INT.P$1 9.75,39.25 9.95,39.05
  Top 0.406: SJ2.1 SJ1.1 | 9.95,41.95 12,44 13,44 13.5,44.5 13.5,47 v15,48.5 | v12.5,57.5 12.6,57.6 U6.24
  Bottom 0.4: 12,54.5 12.2,54.3 14.45,54.3 15,53.75 15,51.5 15.5,51 15.5,49 v15,48.5
  Bottom 0.406: 12,54.5 12,57 v12.5,57.5
ETH_MISO  (via drill 0.3)
  Top 0.2: U6.35 v5.94,58.19 v5.95,58.2
  Bottom 0.2: v5.95,58.2 7.3,58.2 8.5,57 9,57 9.5,57.5 9.5,59 10.5,60 15,60 15.05,59.95 16.45,59.95 17,60.5 18.5,60.5 19,61 22.13,61 MISO.P$1 23.04,61.81 U$2.CN10_13
ETH_MOSI  (via drill 0.3)
  Top 0.2: U6.36 6.89,57.39 v7,57.5
  Bottom 0.2: v7,57.5 8,56.5 9.5,56.5 10,57 10,58.5 10.5,59 13,59 13.5,59.5 17,59.5 17.5,60 21.2,60 21.45,59.75 22.75,59.75 23,60 24.5,60 24.5,60.15 TP4.P$1 25.58,61.23 U$2.CN10_15
ETH_SCK  (via drill 0.3)
  Top 0.2: U6.37 7.09,56.59 v8.5,58
  Bottom 0.2: v8.5,58 8.5,59 10.5,61 TP3.P$1 17.5,61 20.5,64 U$2.CN10_11
ETH_SS  (via drill 0.3)
  Top 0.3: U6.34 v2.01,58.99 v2,59 | SJ4.1 11.15,32.75 11.7,33.3 11.7,41.96 SS.P$1
  Top 0.406: SJ4.1 8.9,32.27 SJ3.1
  Bottom 0.3: v2,59 2,56 4.75,53.25
  Bottom 0.4: 4.75,53.25 5,53 12,53 12.5,52.5 12.5,51 13.5,50 13.5,43.76 SS.P$1
GNDA  (via drill 0.3, 0.5, 0.8)
  Top 0.2: U6.8 11,50.25 10.75,50.5 10.6,50.5 10.38,50.72 | 10.38,50.72 10.15,50.95 9.5,50.95 | 9.5,50.95 8.7,50.95 8.55,50.8 8.55,49.34 U6.5 | U6.6 9.4,50.85 9.5,50.95 | U6.7 10.2,50.55 10.38,50.72 | U6.1 5.4,50.4 5.5,50.5 | C5.P$1 10.2,46.3 v10.5,46 | R6.P$1 10.98,45.48 v10.5,45 | v20.5,50.95 20.45,50.95 19.6,51.8 19.6,51.9 19.5,52 | D2.C 0.81,29.89 0.65,30.05 0.65,32.85 0.7,32.9 1.47,32.9 D1.C 3.11,32.89 v3.5,32.5
  Top 0.254: 8.55,50.8 8.55,51.95 v8.5,52 | 11.5,59 11.5,58.5 v11,58
  Top 0.3: C6.P$1 19.51,50.21 18.8,49.5 v18.6,49.4 | C8.2 17.08,51.42 17.35,51.15 18.77,51.15 C7.P$1 | 2.5,52.5 2.5,52.55 1.75,53.3 1.75,54.55 v1.65,54.65 | C3.P$1 2.95,48.95 v3,49 | U6.39 6.49,54.99 6.5,55 6.5,54.95 v6.55,54.9
  Top 0.4: C9.2 17.01,56.6 17.35,56.6 17.55,56.4 21.6,56.4 C4.P$1 | U6.19 13.59,56.59 v13.5,56.5 | C8.2 16.33,51.79 U6.13 13.79,51.79 v13.5,51.5 | 5.5,50.5 7,50.5 v7,51.5 | C10.P$2 27.4,7.4 26.8,6.8 26.8,5 27.5,4.3 31.9,4.3 U$2.CN7_22 | 24.38,48.69 C19.P$1 24.49,48.72 24.49,48.69 | U6.14 13.59,52.59 v13.5,52.5 | U6.22 13.99,58.99 13.5,58.5 v13.5,58 | C12.P$1 23.2,48 v22.75,47.55
  Top 0.406: C13.P$2 1.78,53.22 2.5,52.5 3.61,52.5 U6.42 | U6.38 5.21,55.79 5.5,55.5 5.5,55 | 5.5,55 5.5,54 | 5.5,54 5.5,53.75 5.15,53.4 U6.41 | U6.40 5.31,54.19 5.5,54 | U6.39 5.49,54.99 5.5,55 | U6.25 11.8,59.3 11.5,59 11,59 | 11,59 10.2,59 | 10.2,59 9.5,59 | 9.5,59 8.5,59 | 8.5,59 7.95,59 | 7.95,59 7,59 | 7,59 6.1,59 | 6.1,59 5.5,59 5.5,60.59 U6.33 | U6.32 6.2,59.1 6.1,59 | U6.31 7,59 | U6.30 7.8,59.15 7.95,59 | U6.29 8.6,59.1 8.5,59 | U6.28 9.4,59.1 9.5,59 | U6.27 10.2,59 | U6.26 11,59 | U6.19 15.99,56.59 16.2,56.8 C9.2 | 24.49,48.69 24.5,48.7 24.5,49.5 v24.8,49.8
  Top 0.8: C43.P$2 26.22,59.72 v26,59.5 | C45.P$2 26.28,56.72 v26,57 | C44.P$2 27.9,53.1 v29,52 | C47.P$2 31.6,49.4 v31.5,49.5 | C46.P$2 38.8,49.3 v39,49.5 | C28.P$2 38.39,46.39 v39,47 | D10.A 37.9,55.1 v39,54 | T2.P$9 49.22,55.72 v49,55.5 | T2.P$8 51.76,55.76 v51.5,55.5 | T2.P$7 54.3,55.8 v54,55.5
  Top 1: C48.P$2 36.42,46.36 C28.P$2
  Bottom 0.2: v10.5,46 10.5,45.95 | v10.5,45 10.5,44.75 10.55,44.75 10.55,44.95 v10.5,45
  Bottom 0.3: v20.5,50.95 20.5,50.9 | v18.6,49.4 18.5,49.4 | v1.65,54.65 1.65,54.7 1.7,54.75 1.7,54.7 | v3,49 3.1,49 3.15,48.95 | v6.55,54.9 6.55,55.05
  Bottom 0.4: v13.5,56.5 13.4,56.5 | v7,51.5 7,51.65
  pour Top: 4.5,50.5 8,50.5 8,48 8.5,47.5 9.5,46.5 9.5,42.5 8,41 4,41 3.5,41.5 3.5,47 4.5,48
  pour Route2: -1,70.3 58.3,70.3 59.3,69.3 59.3,47.5 57.5,45.7 32,45.7 30.6,44.3 30.6,43.6 30.4,43.4 14.7,43.4 14.3,43 14.4,39.3 11.9,39.2 11.6,32.8 13.9,30.5 13.9,28.3 14.7,27.5 14.7,24.1 15.5,23.3 15.5,11.4 14.7,10.6 14.7,8.5 16.8,6.4 56.7,6.4 57.2,5.9 57.2,0.4 55.8,-1 0.8,-1 -1,0.8
INTVCC
  Top 0.3: U4.5 45.94,26.85 | 45.94,26.85 45.94,26.07 C30.P$1 | 48,27.15 47.7,26.85 45.94,26.85
  Top 0.4: D6.C 51.42,33.35 50.25,33.35 49.8,32.9 49.8,29.15 49.65,29 49,29 48.5,28.5 48.5,27.65 48,27.15 | 46,26.28 C30.P$1
LEDA
  Top 0.2: 12.87,12.03 X1.10 12.15,12.64 12.15,22.5 12.9,23.25 12.9,26.2 12,27.1 2.52,27.1 D2.A
  Top 0.4: R3.P$1 5,33.61 5,30.5 2.63,28.13 D2.A
LEDB  (via drill 0.3)
  Top 0.2: D1.A 2.07,31.13 3.1,30.1 3.6,30.1 4.5,31 4.5,34.89 R4.P$2
  Top 0.4: v3.05,30.1 3.1,30.1
  Bottom 0.2: X1.11 14.8,23.61 14.8,27.5 13.7,28.6 13.7,30 13.6,30.1 v3.05,30.1
N$1
  cutout Route2: 7.5,33.3 7.5,36.3 7.4,39.7 10.2,42 13.2,44.4 13.7,44.9 29.8,44.9 30,45.1 30,49.6 26.7,52.9 26.7,55 24.8,56.9 24.8,59.7 26.4,61.3 56.6,61.3 56.6,61.1 26.5,61.1 25,59.6 25,56.9 26.8,55.1 26.8,53 30.1,49.7 30.1,45 29.8,44.7 13.8,44.7 13.3,44.2 9.85,41.6 8.45,40.45 7.65,39.65 7.6,36.2 7.6,33.3
N$3  (via drill 0.3)
  Top 0.2: v49.5,22.5 49.01,22.99 Q4.F1 | Q4.7 49.97,23.4 49.5,23.4
  Top 0.4: Q4.8 51.77,24.23 52,24 | Q4.F1 49.3,23.55 | 49.3,23.55 49.65,23.55 | 52,23.6 49.7,23.6 49.65,23.55 | 49.65,23.55 49.5,23.4 49.3,23.2 49.3,22.9 49.35,22.95 50.14,22.95 | 50.14,22.95 51.95,22.95 | Q4.5 50.17,22.3 52,22.3 | Q4.6 50.14,22.95 | 49.3,23.55 48.85,23.55
  Top 1: J3.P1 52.34,19.16 52,19.5 52,22.3 52,23.6 52,24
  other vias: 49.5,24 48.5,24 48.5,22.5
  pour Bottom (rank 2): 48.5,20.5 52.5,20.5 52.5,26.5 51,26.5 45,26.5 45,20.5
N$4
  Top 1: J3.P2 54.45,24.55 54,25 54,27.47 D19.C
N$5
  Top 0.4: R21.P$1 26.46,14.04 26.46,13.54 27,13 27,12.4 C10.P$1 27.5,11.9 28,11.9 | R20.P$1 28.04,12 | 28.04,12 28.04,11.94 28,11.9 | 28,11.9 28,12 | 28.04,12 28.5,12 29,12.5 29,13 30,14 30.5,14 31,14.5 31,19.5 30.21,20.29 R18.P$1 R19.P$1
N$6
  Top 0.4: C34.P$1 32.11,10.61 32.5,11 33.31,11 FB2.P$1
  Top 1: B1.+ 36.15,21.15 37.45,19.85 37.45,16.25 B2.+ 36.15,14.15 33.39,11.39 FB2.P$1
N$7
  Top 0.2: 45.94,31.86 45.94,31.41 46.25,31.1 46.4,31.1 46.75,30.75 47.05,30.75 47.8,30
  Top 0.25: U4.12 45.94,31.86 | 47.8,30 48.95,30 R31.P$2
N$8
  Top 1: B1.- 35.95,23.95 34.5,22.5 34.5,19.1 B2.- 30.25,11.55 30.25,9.25 30.5,9 C34.P$2 33.27,9.01 FB3.P$1
N$11
  Top 0.2: SJ3.2 8.9,30.7 9.1,30.5 12,30.5 12.2,30.3 12.2,27.4 13.3,26.3 13.3,22.8 14,22.1 14,21.3 12.9,20.2 12.9,13.4 13.9,12.4 13.9,9.4 11.5,7 10,7 9,6 9,4.26 U$2.CN7_1
N$12  (via drill 0.3)
  Top 0.2: SJ4.2 11.93,31.37 12.9,30.4 v12.9,29.3
  Bottom 0.2: v12.9,29.3 12.9,29 13.1,28.7 13.1,28.4 13.9,27.6 13.9,22.9 14.8,22 14.8,21.2 13.4,19.8 13.4,13.7 14.5,12.6 14.5,9 11.5,6 11.5,4 10.56,3.06 U$2.CN7_3
N$13  (via drill 0.3)
  Top 0.2: v7.8,27.8 8.6,27.8 8.9,28.1 8.9,28.88 SJ2.2
  Bottom 0.2: v7.8,27.8 8.5,27.1 12,27.1 12.9,26.2 12.9,23.25 12.15,22.5 12.15,10.85 13,10 13,9 11,7 9.2,7 U$2.CN7_2
N$14  (via drill 0.3)
  Top 0.2: v9.7,27.9 10.8,27.9 11.2,28.3 11.2,28.97 SJ1.2
  Bottom 0.2: v9.7,27.9 11.7,27.9 13.3,26.3 13.3,22.8 14,22.1 14,21.3 12.9,20.2 12.9,13.4 13.9,12.4 13.9,9.16 U$2.CN7_4 10.3,5.64
N$15
  Top 0.3: 39.47,27.72 R27.P$1
  Top 0.35: C33.P$2 39.02,28.05 R27.P$1
N$16
  Top 0.4: R15.P$1 C22.P$1
N$18
  Top 0.25: U5.2 41.66,13.66 41.5,13.5 41.5,12.84 R23.P$1
N$19
  Top 0.25: U5.3 42.91,13.66 42.75,13.5 42.75,12.81 R29.P$2
N$22
  Top 0.2: 47,31.5 46.5,31.5 46.45,31.55 46.45,32.05 46.44,32.06
  Top 0.25: U4.11 46.44,32.06 | 47,31.5 48.8,31.5 R33.P$2
  Top 0.265: 46.44,34 U4.11
  Top 0.4: 46.44,34 C39.P$1
N$23
  Top 0.4: R33.P$1 51.96,31.49 C38.P$1
N$24
  Top 0.3: U4.6 46.44,28.66 46.15,28.95 42.52,28.95 R28.P$2
N$25
  Top 0.4: Q3.4 42.25,31.76 42.5,31.5 42.5,30.57 R28.P$1
N$26
  Top 0.3: U4.7 46.94,28.91 46.1,29.75 41.1,29.75 40.95,29.9
  Top 0.35: Q3.1 39.89,31.51 40.05,31.35 40.5,31.35 | 40.5,31.35 41,31.35 | 41,31.35 41.2,31.35 Q3.3 | R32.P$1 40.95,31.3 41,31.35 | Q3.2 40.55,31.4 40.5,31.35
  Top 0.4: R32.P$1 40.95,29.9
N$28  (via drill 0.3)
  Top 0.4: 41.59,34.55 41.5,34.5 | 41.5,34.5 Q3.F1 | R24.P$1 42.81,35.81 42.5,35.5 41.97,35.5 Q3.5 | Q3.5 41.84,34.8 41.59,34.55 | Q3.6 41.19,34.81 41.5,34.5 | Q3.5 41.85,36.55 | 41.2,35.4 41.2,36.5 41,36.7 | Q3.7 40.55,36.66 40.5,36.7 | Q3.8 39.89,36.59 40,36.7 | Q3.F1 39.72,34.22 38.5,33 38.5,32 38.25,31.75 | 38.25,31.75 38,31.5 37.21,31.5 D3.A | C33.P$1 39.02,30.98 38.25,31.75 | Q3.7 40.55,34.55 Q3.F1 | Q3.7 40.55,35.49 40.55,35.5 | 41.59,34.55 41.59,34.59 v41.65,34.65
  Top 1: T2.P$1 41.6,36.85 41.45,36.7 41,36.7 40.5,36.7 40,36.7 39.85,36.7
  other vias: 40.1,34.65 41.65,33.8 40.1,33.8
  pour Bottom: 37.5,37.5 37.5,29.5 44.5,29.5 44.5,37.5
N$29
  Top 0.4: T2.P$5 51.76,36.76 52.02,36.5 52.5,36.5 54.21,34.79 D6.A
N$31
  Top 0.4: U4.16 43.94,34.03 R24.P$2
N$32
  Top 0.4: U4.14 44.94,33.19 45.2,33.45 45.2,34.15 R34.P$2
N$33
  Top 0.4: D3.C 35.5,28.18 | C21.P$2 35.1,32.4 35.5,32 35.5,28.18 | 35.5,28.18 R16.P$1
N$37
  Top 0.25: U6.2 6.2,45.85 C1.P$1 6.22,43.63 Y1.1
N$39
  Top 0.265: C11.P$2 23.02,52.38 21.6,53.8 21,53.8 20.1,54.7 18.75,54.7 R8.P$2 17.96,55.46 17.5,55 U6.17
N$40
  Top 0.254: R5.P$1 25.22,50.78 26,50 26,48.81 C19.P$2
  Top 0.265: T1.4 23.96,46.67 C19.P$2
N$41  (via drill 0.3)
  Top 0.2: U6.9 11.8,50.7 10.5,52 v10,52 | v4.5,38.5 4.5,36.67 R4.P$1
  Bottom 0.2: v4.5,38.5 6.5,40.5 7.5,40.5 11.5,44.5 11.5,51 10.5,52 v10,52
N$42  (via drill 0.3)
  Top 0.2: 12.6,50.9 12.5,51 | v6.5,38.5 6.5,36.71 R3.P$2
  Top 0.4: U6.10 12.6,50.9 v11.5,52
  Bottom 0.2: v6.5,38.5 12,44 12,51.5 v11.5,52
N$45
  Top 0.4: U6.11 13.4,48.07 R6.P$2
N$47
  Top 0.25: U6.3 7,47.31 C2.P$1 6.99,45.51 7,45.5 7,44.46 Y1.3
N$48
  Top 0.4: C27.P$2 26.47,15.67 R21.P$2
N$50
  Top 0.4: C24.P$2 26.46,21.91 R18.P$2
N$51
  Top 0.4: C25.P$2 27.91,21.92 R19.P$2
N$52
  Top 0.4: C26.P$2 27.92,15.66 R20.P$2
N$53
  Top 0.6: J4.P2 51.44,18.56 C40.P$1 49.06,18.56 48.5,18 48.5,16.5 49,16 49,15.8 FB4.P$1
N$54  (via drill 0.6)
  Top 0.4: R35.P$1 47.44,17.66 R36.P$2 47.46,19.13 C42.P$1 48.42,20.58 v48.6,20.5 | v39.4,21 40.17,21 U5.8
  Bottom 0.4: v48.6,20.5 40,20.5 v39.4,21
N$55
  Top 0.6: J4.P1 52.99,13.01 52.5,13.5 52.5,16 51.5,17 50.5,17 | FB5.P$1 50.53,13.03 51,13.5 51,15.5 50.5,16 50.5,17 | 50.5,17 49.76,17 C40.P$2
N$59
  Top 0.265: C15.P$2 21.6,53 21.3,53.3 20.8,53.3 19.9,54.2 18.6,54.2 18.3,54.5 18,54.5 17.9,54.4 17.9,53.33 R9.P$2 17.8,53.43 17.8,53.5 16.68,53.5 15.99,54.19 U6.16
N$76
  Top 0.25: 48.65,14.35 48.65,11.05
  Top 0.4: FB4.P$2 47.87,15.13 48.65,14.35 | 48.65,11.05 D18.A
  Top 0.6: FB4.P$2 46.14,15.33 C41.P$1 46.07,17.43 R35.P$2
POE_A+  (via drill 0.6)
  Top 0.4: B1.AC1 29.9,24 27,24 26.46,24.54 C24.P$1 26.5,24.84 26.5,25.4 v27.1,26 | T1.11 23.96,27.46 v23.5,27
  Bottom 0.4: v27.1,26 26.1,27 v23.5,27
POE_A-  (via drill 0.6)
  Top 0.4: B1.AC2 30,21.5 30,22.5 31,23.5 31,24.5 30.7,24.8 C25.P$1 28,24.89 28,25.5 28.5,26 v29,26 | T1.12 21.42,28.58 22,28 v22.5,28
  Bottom 0.4: v22.5,28 27,28 v29,26
POE_B+
  Top 0.4: X1.4 20.04,18.12 X1.5 24.1,17.1 25.5,18.5 26.36,18.5 C27.P$1 26.47,18.97 27,19.5 28.8,19.5 30,18.3 30,17.5 B2.AC1
POE_B-
  Top 0.4: B2.AC2 29,15.9 29,18 28.39,18.61 C26.P$1 27.9,18.59 27.9,17.9 27.8,17.8 25.8,17.8 23.07,15.07 X1.7 20.04,14.05 X1.8
RTN  (via drill 0.3, 0.5, 0.8)
  Top 0.3: U4.8 47.44,29.26 46.25,30.45 45.7,30.45 v45.3,30.85 45.35,30.8 45.5,31 | U4.9 48.25,32.55 v48.55,32.85 | v45.85,24.85 45.85,24.8 46.05,24.6
  Top 0.4: C41.P$2 45.34,13.66 45,14 45,20.5 | 45,20.5 44.75,20.75 44.17,20.75 U5.5 | 45,20.5 45.08,20.58 C42.P$2 45.84,20.56 | R36.P$1 45.84,20.56 | C30.P$2 47.5,26.18 47.5,25 46.96,24.46 Q4.1 46.33,24.19 46.15,24 | v49.5,36 49.29,35.79 C37.P$2 47.96,35.81 C39.P$2 R34.P$1 | C38.P$2 53.59,30.59 53,30 v52,30 v51.99,29.99 R31.P$1 | v38,26 38.11,26.11 39.36,26.11 R27.P$2 | D13.A 40.35,23.65 v40.5,23.5 | Q4.3 46.22,22.88 | 46.22,22.88 46.15,22.95 46.15,23.5 | 46.15,23.5 46.15,24 | 46.15,24 46.15,24.5 46.05,24.6 44.51,24.6 R26.P$1 | Q4.2 46.19,23.53 46.15,23.5 | 46.22,22.88 46.22,23.5 45.5,23.5 | 45.84,20.56 45.84,21.36 v45.25,21.75
  Top 0.6: FB5.P$2 46.7,13.03 C41.P$2
  Top 0.8: R32.P$2 40.95,27.05 | C28.P$1 37,43.19 38.31,43.19 v38.5,43
  Top 1: T2.P$6 v54.3,42.5 | C32.P$2 35.69,36.5 | 35.69,36.5 v34,36.5 | 35.69,36.5 v35.75,36.5 v37.5,36.5 | 40.95,27.05 v41,27 | C48.P$1 36.97,43.16 37,43.19
  Bottom 0.3: v45.3,30.85 45.4,31.05 45.45,31 45.5,31
  Bottom 0.4: 49.5,36.15 v49.5,36 | v48.55,32.85 48.65,32.85 48.5,33 | 49.05,26.05 v49,26 | v38,26 37.9,26 | 40.5,23.6 v40.5,23.5 | v45.25,21.75 45.25,21.55 45.35,21.65 | v52,30 52.05,30 52.1,30.05 52.05,30.05 v52,30
  Bottom 1: v54.3,42.5 54.25,42.5 | v41,27 41,27.15
  other vias: 45.65,23.7 23.3,25.6
  pour Route2 (rank 3): 56,8.5 30,8.5 30,13 33,15.5 32.6,43.7 57.5,43.5 57.5,12 56,10.5
  pour Route2 (rank 5): 16.8,28.9 31.9,28.9 39,36 57.2,36 57.2,12.2 55.6,10.6 55.6,8.8 30.4,8.8 29.9,9.3 29.9,10.9 29.2,11.6 25.2,11.6 24.4,10.8 24.4,8.5 24.2,8.3 19.6,8.3 19.2,9.2 19.2,10.4 17.6,10.8 17.6,11.8 17.5,12.9 17.5,20.7 17.8,21.5 17.8,23.9 17.3,24.55 16.6,25.3 16.6,28.6
  pour Route15 (rank 5): 16.3,28.9 31.9,28.9 39,36 57.2,36 57.2,12.2 55.6,10.6 55.6,8.8 30.4,8.8 29.9,9.3 29.9,10.9 29.2,11.6 25.2,11.6 24.4,10.8 24.4,8.5 24.2,8.3 17.6,8.3 17.2,8.7 17.2,10.4 18.6,11.8 18.6,13.3 18,13.9 18,19.2 17.5,19.7 17.5,20.7 18.8,22 18.8,23.9 17.8,24.9 17.5,24.9 16.6,25.8 16.6,28.6
RX+  (via drill 0.5)
  Top 0.265: v17.4,28.1 17.4,28.6 16.4,29.6 16.4,30.06 T1.14
  Bottom 0.265: X1.3 18.07,19.13 17.5,19.7 17.5,20.7 18,21.2 19.2,21.2 19.5,21.5 19.5,26.8 19,27.3 18.2,27.3 v17.4,28.1
RX-  (via drill 0.5)
  Top 0.265: v18.9,28.1 18.9,30.1 T1.13
  Bottom 0.265: X1.6 18.52,16.32 20.3,18.1 21.6,18.1 22.1,18.6 22.1,19.8 21.8,20.1 20.6,20.1 20,20.7 20,27 v18.9,28.1
SGND
  Top 0.8: X1.GND@1 21.28,25.66 X1.GND@3 | X1.GND@2 21.28,9.57 X1.GND@4
  Bottom 0.8: X1.GND@4 X1.GND@3 22.97,23.97
TPIN+
  Top 0.265: C15.P$1 21.44,50.74 18.6,47.9 17.7,47.9 16.34,46.54 T1.1
TPIN-
  Top 0.265: T1.2 18.88,47.38 21.5,50 23,50 23.1,50.1 23.1,50.73 C11.P$1
TPINCT  (via drill 0.3)
  Top 0.2: C12.P$2 22.46,49.55 23.5,49.55 23.75,49.8 23.75,51.25 23.5,51.5 21,51.5 20.5,52 v20.5,52.5 19.71,53.29 R9.P$1
  Top 0.265: T1.3 21.6,46.3 C12.P$2
  Top 0.4: R8.P$1 v20.49,55.49 v20.5,55.5
  Bottom 0.2: v20.5,52.5 v20.5,55.5
  Bottom 0.4: v20.5,55.5 20.45,55.5 20.4,55.55
TPOUT+
  Top 0.265: T1.5 27.22,46.12 28,46.9 28,47.3 28.5,47.8 28.5,48.6 25.5,51.6 25.5,53.9 21.4,58 18.7,58 18.7,57.98 R13.P$1 17.99,57.31 17.6,57.7 17.2,57.7 17.1,57.6 16.5,57.6 16.4,57.5 15.21,57.5 U6.20
TPOUT-
  Top 0.265: T1.6 29.04,47.46 29,47.5 29,48.8 26,51.8 26,54 21.5,58.5 18.76,58.5 R12.P$1 16.91,58.19 U6.21
TRAFO_OUT
  Top 0.4: C22.P$2 37.55,58.51 D4.A
  Top 1: T2.P$10 46.68,56.18 46,55.5 44,55.5 | 44,55.5 41,55.5 40.25,56.25 | 40.25,56.25 39.5,57 39.5,58 39,58.5 37.54,58.5 D4.A | T2.P$11 44.14,55.64 44,55.5 | T2.P$12 41.6,57.6 40.25,56.25
TX+
  Top 0.265: X1.1 21.43,21.17 22,20.6 23.2,20.6 24.8,22.2 24.8,26.1 28,29.3 28,30.9 27.9,31 27.6,31 27.5,30.9 27.5,30.2 27.4,30.1 26.52,30.1 T1.10
TX-
  Top 0.265: X1.2 23.45,20.15 25.3,22 25.3,25.9 28.8,29.4 28.8,29.88 T1.9
U4_EN
  Top 0.3: U4.3 44.94,27.44 44.5,27 44.5,26.46 R22.P$1
  Top 0.4: Q4.4 46.06,22.23 45.45,22.85 44.48,22.85 R26.P$2 44.34,22.91 43.6,23.65 D13.C | U5.6 42.91,22.2 42.55,22.55 42.55,23.61 D13.C | 44.53,26.38 R22.P$1 43.55,25 43,25 42.85,24.85 42.85,23.99 D13.C
U4_SS
  Top 0.2: 47.49,33.7 C37.P$1
  Top 0.3: U4.10 46.94,33.29 47.05,33.4 47.19,33.4 47.49,33.7
VCAP
  Top 0.406: C13.P$1 3.67,51.76 U6.43
VDD  (via drill 0.3, 0.5, 0.8)
  Top 0.3: 42,25.5 v41.75,25.5 | U4.1 43.94,26.94 43.5,26.5 43.45,26.5 R22.P$2
  Top 0.4: 40.39,15 39.5,15 38.96,15.54 C35.P$1 38.65,15.41 38.65,14.6 39,14.25 v39,14 | 40.39,15 U5.1 40.41,13.34 R23.P$2 39.84,12.84 40.5,13.5 40.5,15 40.39,15 | 42,25.5 42.45,25.5 R22.P$2 | C21.P$1 33.35,31.65 v34,31 34,29.84 R16.P$2
  Top 0.8: FB2.P$2 40.12,10.92 D12.C | D19.A 50.5,27.47 v50.5,26
  Top 0.84: D12.C v44.26,9.26 44.5,9.5 46.7,9.5 D18.C | 40.12,10.92 40.12,10.88 42,9 42.25,9.25 v44.25,9.25
  Top 1: T2.P$3 46.68,42.5 | 46.68,42.5 v45,42.5 | 46.68,42.5 v47,42.5 v49,42.5 | C32.P$1 v35.69,38.5 | v35.69,38.5 v34,38.5 | v35.69,38.5 v35.7,38.5 v37.5,38.5
  Bottom 0.3: v41.75,25.5 41.85,25.5
  Bottom 0.4: v39,14 38.85,14 38.8,13.95 38.95,13.95 v39,14
  Bottom 0.84: v44.25,9.25 44.25,9.35
  Bottom 1: v49,42.5 48.85,42.5
  pour Route15 (rank 3): 56,8.6 30,8.6 30,13.1 31,14.1 31,25.6 32.5,27.1 32.5,43.6 57.5,43.6 57.5,12.1 56,10.6
VIN  (via drill 0.8)
  Top 0.4: R15.P$2 32.9,60.9 32,60 31.38,60 C43.P$1
  Top 0.8: v38.5,52 38,52.5 C46.P$1 32,52.5 | 31.5,53 31.5,52 | 31.5,52 v31,51.5 | 31.5,52 32,52.5 | 32,52.5 31,53.5
  Top 1: C46.P$1 33.61,52.5 C47.P$1 33.41,52.5 32,52.5 31.5,53 31.1,53.4 C44.P$1 C45.P$1 C43.P$1 31.1,58.6 31,58.5 32.82,58.5 D4.C 33.03,56.97 33.5,56.5 33.5,55.15 D10.C
  pour Route15: 56.5,46 56.55,60.8 26.65,60.8 25.35,59.45 25.3,57.05 27.15,55.3 27.1,53.1 30.4,49.9 30.5,45 30,44.4 13.95,44.4 8,39.5 8,33 7.5,32.5 7,33 7,35.5 0.5,35.5 0.5,-0.5 57,-0.5 57,6.5 16.5,6.5 14.5,8.5 14.5,11 15,11.5 15,23 14.5,23.5 14.5,27.5 13.5,28.5 13.5,31 12,32.5 12,39 12.5,39.5 14,39.5 14.5,40 14.5,43 15,43.5 30.5,43.5 30.5,44 32.5,46
VSS  (via drill 0.3, 0.5, 0.8)
  Top 0.4: 41.53,17.14 U5.POWERPAD | U5.4 44.16,13.01 | 44.16,13.01 R29.P$1 | 44.16,13.01 44.16,11.75 v44.4,11.5
  Top 0.8: FB3.P$2 36.99,8.87 D12.A 37.64,9 v39.5,9
  Bottom 0.4: v44.4,11.5 44.55,11.5
  other vias: 39.95,18.8 39.95,17.25 41.15,18.65 42.3,18.65 43.35,18.65 41.15,17.15 42.25,17.15 43.35,17.15
  pour Route2: 30,8.5 56.5,8.5 56.5,11 57.5,12 57.5,20.5 30,20.5
  pour Top: 36.5,11.5 47,11.5 47,22.5 36.5,22.5
  pour Bottom (rank 4): 32,23 52,23 52,13 32,13
  pour Top (rank 2, no thermals): 40.3,19.3 44.25,19.3 44.35,19.2 44.35,16.7 44.2,16.55 40.4,16.55 40.35,16.6 40.35,19.25

### Text on the board
tPlace: 48V / 0A3 / -OUT+ | AC | DC | 48V / 0A3 / -IN+
bPlace: http://ell-i.org/ | ELL-i | Open source co-operative | PoELLi-Nucleo 1.0 | OPEN HARDWARE | https://github.com/Ell-i / /ELL-i-Eagle-Boards | QC pass